# Altium project RELAY_BOARD_V1.PrjPcb (part 1 of 2)
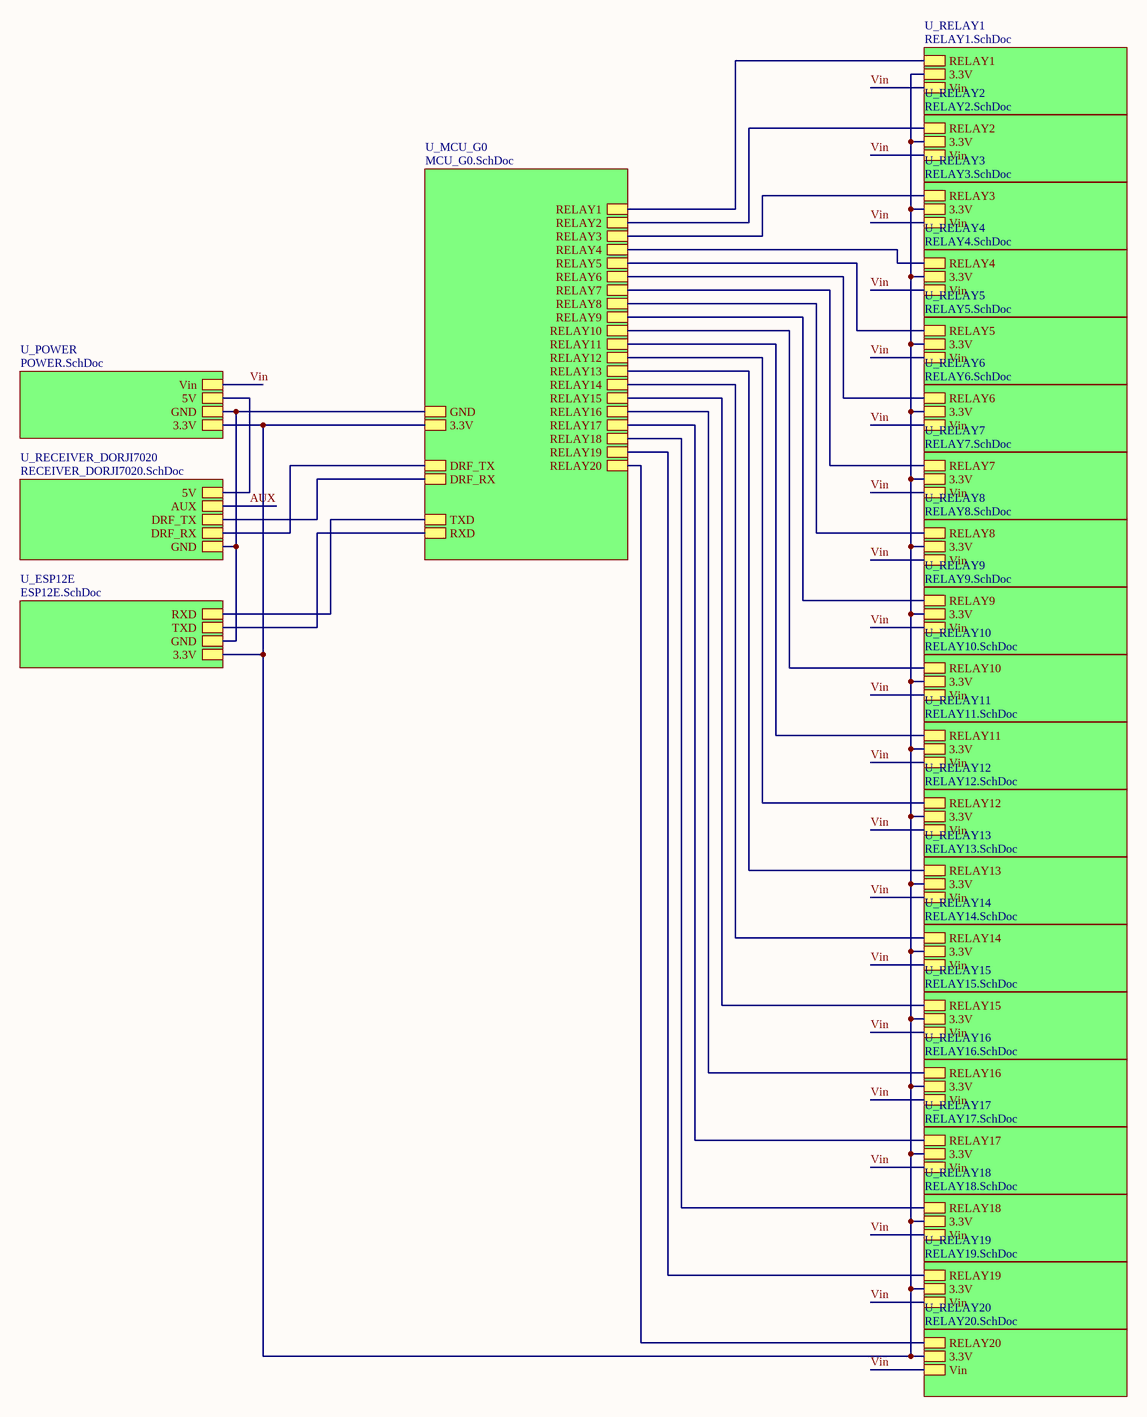
[diagram p0: RELAY_BOARD_V1.SchDoc]
25 sheets, 160 parts. Net scope: hierarchical (ports join the sheet entries above them; power ports are global).
Board files: RELAY_BOARD_V1_Assembly.PcbDoc, RELAY_BOARD_V1.PcbDoc
Sheets:
  RELAY_BOARD_V1.SchDoc
    U_MCU_G0 = MCU_G0.SchDoc
    U_RECEIVER_DORJI7020 = RECEIVER_DORJI7020.SchDoc
    U_ESP12E = ESP12E.SchDoc
    U_POWER = POWER.SchDoc
    U_RELAY1 = RELAY1.SchDoc
    U_RELAY2 = RELAY2.SchDoc
    U_RELAY3 = RELAY3.SchDoc
    U_RELAY4 = RELAY4.SchDoc
    U_RELAY5 = RELAY5.SchDoc
    U_RELAY6 = RELAY6.SchDoc
    U_RELAY7 = RELAY7.SchDoc
    U_RELAY8 = RELAY8.SchDoc
    U_RELAY9 = RELAY9.SchDoc
    U_RELAY10 = RELAY10.SchDoc
    U_RELAY11 = RELAY11.SchDoc
    U_RELAY12 = RELAY12.SchDoc
    U_RELAY13 = RELAY13.SchDoc
    U_RELAY14 = RELAY14.SchDoc
    U_RELAY15 = RELAY15.SchDoc
    U_RELAY16 = RELAY16.SchDoc
    U_RELAY17 = RELAY17.SchDoc
    U_RELAY18 = RELAY18.SchDoc
    U_RELAY19 = RELAY19.SchDoc
    U_RELAY20 = RELAY20.SchDoc

## Sheet RELAY_BOARD_V1.SchDoc
size A3

### Sub-sheets
U_ESP12E = ESP12E.SchDoc: RXD, TXD, GND, 3.3V
U_MCU_G0 = MCU_G0.SchDoc: DRF_TX, DRF_RX, TXD, RXD, 3.3V, GND, RELAY1, RELAY3, RELAY2, RELAY4, RELAY5, RELAY6, RELAY7, RELAY8, RELAY10, RELAY9, RELAY11, RELAY12, RELAY13, RELAY14, RELAY15, RELAY16, RELAY17, RELAY18, RELAY19, RELAY20
U_POWER = POWER.SchDoc: Vin, 5V, GND, 3.3V
U_RECEIVER_DORJI7020 = RECEIVER_DORJI7020.SchDoc: 5V, AUX, DRF_TX, DRF_RX, GND
U_RELAY1 = RELAY1.SchDoc: RELAY1, 3.3V, Vin
U_RELAY2 = RELAY2.SchDoc: RELAY2, 3.3V, Vin
U_RELAY3 = RELAY3.SchDoc: RELAY3, 3.3V, Vin
U_RELAY4 = RELAY4.SchDoc: RELAY4, 3.3V, Vin
U_RELAY5 = RELAY5.SchDoc: RELAY5, 3.3V, Vin
U_RELAY6 = RELAY6.SchDoc: RELAY6, 3.3V, Vin
U_RELAY7 = RELAY7.SchDoc: RELAY7, 3.3V, Vin
U_RELAY8 = RELAY8.SchDoc: RELAY8, 3.3V, Vin
U_RELAY9 = RELAY9.SchDoc: RELAY9, 3.3V, Vin
U_RELAY10 = RELAY10.SchDoc: RELAY10, 3.3V, Vin
U_RELAY11 = RELAY11.SchDoc: RELAY11, 3.3V, Vin
U_RELAY12 = RELAY12.SchDoc: RELAY12, 3.3V, Vin
U_RELAY13 = RELAY13.SchDoc: RELAY13, 3.3V, Vin
U_RELAY14 = RELAY14.SchDoc: RELAY14, 3.3V, Vin
U_RELAY15 = RELAY15.SchDoc: RELAY15, 3.3V, Vin
U_RELAY16 = RELAY16.SchDoc: RELAY16, 3.3V, Vin
U_RELAY17 = RELAY17.SchDoc: RELAY17, 3.3V, Vin
U_RELAY18 = RELAY18.SchDoc: RELAY18, 3.3V, Vin
U_RELAY19 = RELAY19.SchDoc: RELAY19, 3.3V, Vin
U_RELAY20 = RELAY20.SchDoc: RELAY20, 3.3V, Vin

### Nets
3.3V: sheet U_MCU_G0/3.3V, sheet U_ESP12E/3.3V, sheet U_POWER/3.3V, sheet U_RELAY1/3.3V, sheet U_RELAY2/3.3V, sheet U_RELAY3/3.3V, sheet U_RELAY4/3.3V, sheet U_RELAY5/3.3V, sheet U_RELAY6/3.3V, sheet U_RELAY7/3.3V, sheet U_RELAY8/3.3V, sheet U_RELAY9/3.3V, sheet U_RELAY10/3.3V, sheet U_RELAY11/3.3V, sheet U_RELAY12/3.3V, sheet U_RELAY13/3.3V, sheet U_RELAY14/3.3V, sheet U_RELAY15/3.3V, sheet U_RELAY16/3.3V, sheet U_RELAY17/3.3V, sheet U_RELAY18/3.3V, sheet U_RELAY19/3.3V, sheet U_RELAY20/3.3V
GND: sheet U_MCU_G0/GND, sheet U_RECEIVER_DORJI7020/GND, sheet U_ESP12E/GND, sheet U_POWER/GND
Vin: sheet U_RECEIVER_DORJI7020/5V, sheet U_POWER/Vin, sheet U_POWER/5V, sheet U_RELAY1/Vin, sheet U_RELAY2/Vin, sheet U_RELAY3/Vin, sheet U_RELAY4/Vin, sheet U_RELAY5/Vin, sheet U_RELAY6/Vin, sheet U_RELAY7/Vin, sheet U_RELAY8/Vin, sheet U_RELAY9/Vin, sheet U_RELAY10/Vin, sheet U_RELAY11/Vin, sheet U_RELAY12/Vin, sheet U_RELAY13/Vin, sheet U_RELAY14/Vin, sheet U_RELAY15/Vin, sheet U_RELAY16/Vin, sheet U_RELAY17/Vin, sheet U_RELAY18/Vin, sheet U_RELAY19/Vin, sheet U_RELAY20/Vin
RELAY1: sheet U_MCU_G0/RELAY1, sheet U_RELAY1/RELAY1
RELAY2: sheet U_MCU_G0/RELAY2, sheet U_RELAY2/RELAY2
RELAY3: sheet U_MCU_G0/RELAY3, sheet U_RELAY3/RELAY3
RELAY4: sheet U_MCU_G0/RELAY4, sheet U_RELAY4/RELAY4
RELAY5: sheet U_MCU_G0/RELAY5, sheet U_RELAY5/RELAY5
RELAY6: sheet U_MCU_G0/RELAY6, sheet U_RELAY6/RELAY6
RELAY7: sheet U_MCU_G0/RELAY7, sheet U_RELAY7/RELAY7
RELAY8: sheet U_MCU_G0/RELAY8, sheet U_RELAY8/RELAY8
RELAY9: sheet U_MCU_G0/RELAY9, sheet U_RELAY9/RELAY9
RELAY10: sheet U_MCU_G0/RELAY10, sheet U_RELAY10/RELAY10
RELAY11: sheet U_MCU_G0/RELAY11, sheet U_RELAY11/RELAY11
RELAY12: sheet U_MCU_G0/RELAY12, sheet U_RELAY12/RELAY12
RELAY13: sheet U_MCU_G0/RELAY13, sheet U_RELAY13/RELAY13
RELAY14: sheet U_MCU_G0/RELAY14, sheet U_RELAY14/RELAY14
RELAY15: sheet U_MCU_G0/RELAY15, sheet U_RELAY15/RELAY15
RELAY16: sheet U_MCU_G0/RELAY16, sheet U_RELAY16/RELAY16
RELAY17: sheet U_MCU_G0/RELAY17, sheet U_RELAY17/RELAY17
RELAY18: sheet U_MCU_G0/RELAY18, sheet U_RELAY18/RELAY18
RELAY19: sheet U_MCU_G0/RELAY19, sheet U_RELAY19/RELAY19
RELAY20: sheet U_MCU_G0/RELAY20, sheet U_RELAY20/RELAY20
RXD: sheet U_MCU_G0/TXD, sheet U_ESP12E/RXD
TXD: sheet U_MCU_G0/RXD, sheet U_ESP12E/TXD
UART1_RX_MCU_DRF_TX: sheet U_MCU_G0/DRF_TX, sheet U_RECEIVER_DORJI7020/DRF_RX
UART1_TX_MCU_DRF_RX: sheet U_MCU_G0/DRF_RX, sheet U_RECEIVER_DORJI7020/DRF_TX

## Sheet MCU_G0.SchDoc
size A1
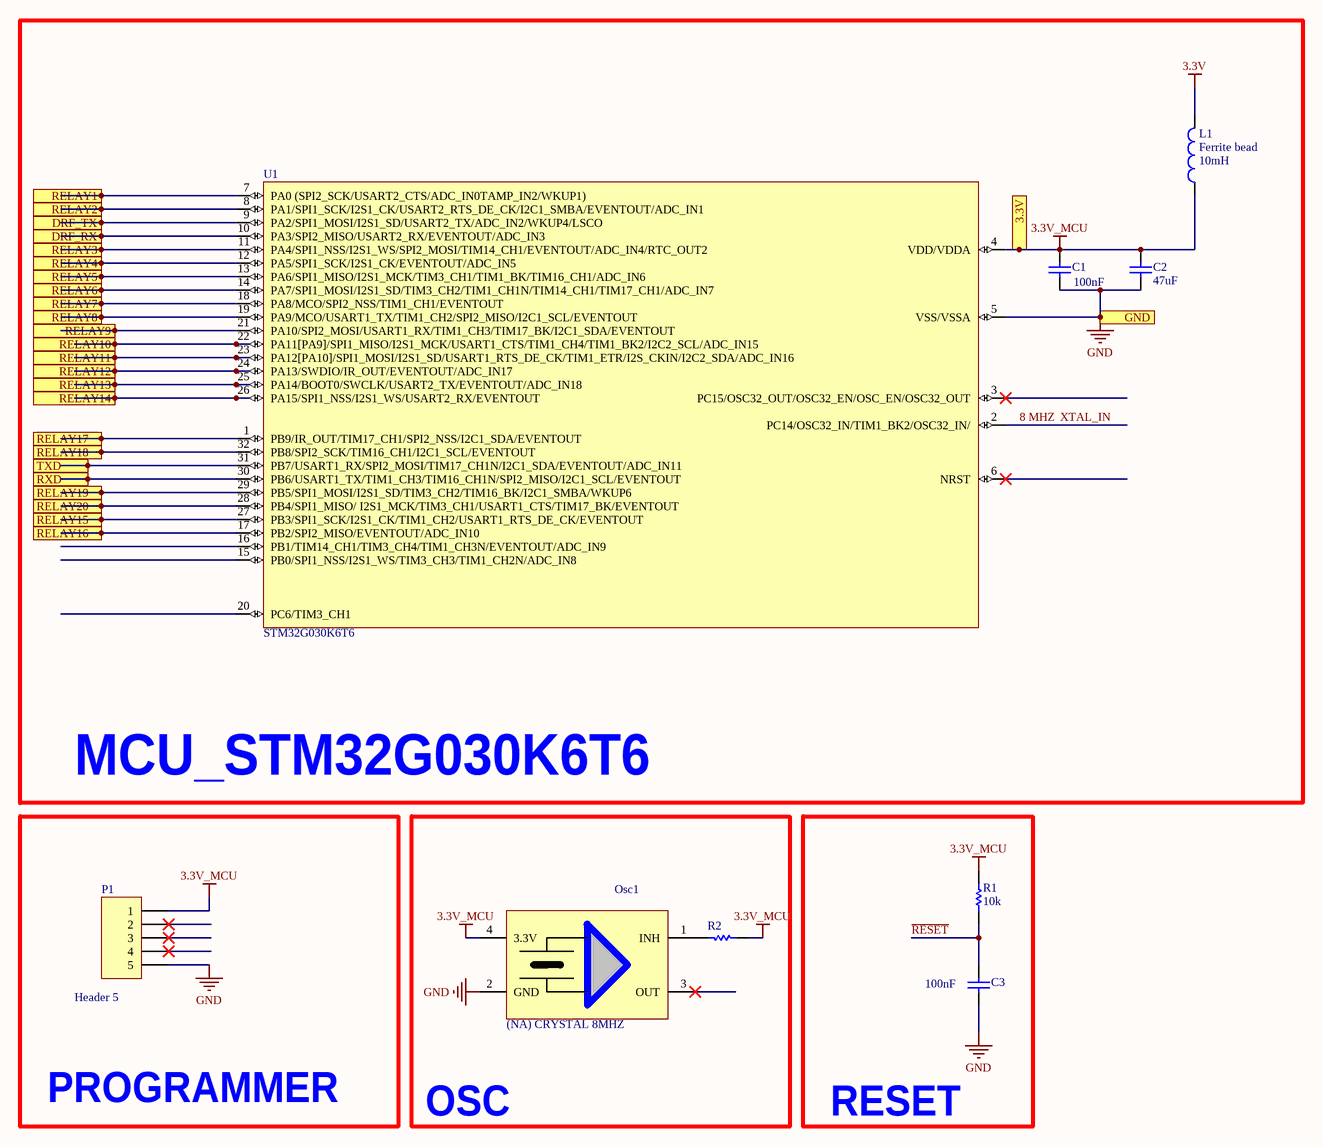
[diagram p1: MCU_G0.SchDoc]

### Parts
C1  100nF  [0603 - RESISTOR]
C2  47uF  [0603 - RESISTOR]
C3  100nF  [0603 - RESISTOR]
L1  Ferrite bead  value 10mH  [0603 - RESISTOR]
Osc1  (NA) CRYSTAL 8MHZ  [XTAL_5X7]
P1  Header 5  [HDR1X5_2mm_small]
R1  10k  [0603 - RESISTOR]
R2  (NA)10k  [0603 - RESISTOR]  (value not drawn)
U1  STM32G030K6T6  [LQFP32]

### Blocks framed on the sheet
MCU_STM32G030K6T6: C1 C2 L1 U1
PROGRAMMER: P1
OSC: Osc1 R2
RESET: C3 R1

### Ports
3.3V, DRF_RX, DRF_TX, GND, RELAY1, RELAY2, RELAY3, RELAY4, RELAY5, RELAY6, RELAY7, RELAY8, RELAY9, RELAY10, RELAY11, RELAY12, RELAY13, RELAY14, RELAY15, RELAY16, RELAY17, RELAY18, RELAY19, RELAY20, RXD, TXD

### Nets
3.3V: C1.2 C2.2 L1.1 L1.2 Osc1.4(3.3V) P1.1 R1.2 R2.1 U1.4(VDD/VDDA) ; port 3.3V  [also labelled 3.3V_MCU]
GND: C1.1 C2.1 C3.1 Osc1.2(GND) P1.5 U1.5(VSS/VSSA) ; port GND
8 MHZ: U1.2(PC14/OSC32_IN/TIM1_BK2/OSC32_IN/)  [also labelled XTAL_IN]
~{RESET}: C3.2 R1.1
RELAY1: U1.7(PA0_(SPI2_SCK/USART2_CTS/ADC_IN0TAMP_IN2/WKUP1)) ; port RELAY1
RELAY2: U1.8(PA1/SPI1_SCK/I2S1_CK/USART2_RTS_DE_CK/I2C1_SMBA/EVENTOUT/ADC_IN1) ; port RELAY2
RELAY3: U1.11(PA4/SPI1_NSS/I2S1_WS/SPI2_MOSI/TIM14_CH1/EVENTOUT/ADC_IN4/RTC_OUT2) ; port RELAY3
RELAY4: U1.12(PA5/SPI1_SCK/I2S1_CK/EVENTOUT/ADC_IN5) ; port RELAY4
RELAY5: U1.13(PA6/SPI1_MISO/I2S1_MCK/TIM3_CH1/TIM1_BK/TIM16_CH1/ADC_IN6) ; port RELAY5
RELAY6: U1.14(PA7/SPI1_MOSI/I2S1_SD/TIM3_CH2/TIM1_CH1N/TIM14_CH1/TIM17_CH1/ADC_IN7) ; port RELAY6
RELAY7: U1.18(PA8/MCO/SPI2_NSS/TIM1_CH1/EVENTOUT) ; port RELAY7
RELAY8: U1.19(PA9/MCO/USART1_TX/TIM1_CH2/SPI2_MISO/I2C1_SCL/EVENTOUT) ; port RELAY8
RELAY9: U1.21(PA10/SPI2_MOSI/USART1_RX/TIM1_CH3/TIM17_BK/I2C1_SDA/EVENTOUT) ; port RELAY9
RELAY10: U1.22(PA11[PA9]/SPI1_MISO/I2S1_MCK/USART1_CTS/TIM1_CH4/TIM1_BK2/I2C2_SCL/ADC_IN15) ; port RELAY10
RELAY11: U1.23(PA12[PA10]/SPI1_MOSI/I2S1_SD/USART1_RTS_DE_CK/TIM1_ETR/I2S_CKIN/I2C2_SDA/ADC_IN16) ; port RELAY11
RELAY12: U1.24(PA13/SWDIO/IR_OUT/EVENTOUT/ADC_IN17) ; port RELAY12
RELAY13: U1.25(PA14/BOOT0/SWCLK/USART2_TX/EVENTOUT/ADC_IN18) ; port RELAY13
RELAY14: U1.26(PA15/SPI1_NSS/I2S1_WS/USART2_RX/EVENTOUT) ; port RELAY14
RELAY15: U1.27(PB3/SPI1_SCK/I2S1_CK/TIM1_CH2/USART1_RTS_DE_CK/EVENTOUT) ; port RELAY15
RELAY16: U1.17(PB2/SPI2_MISO/EVENTOUT/ADC_IN10) ; port RELAY16
RELAY17: U1.1(PB9/IR_OUT/TIM17_CH1/SPI2_NSS/I2C1_SDA/EVENTOUT) ; port RELAY17
RELAY18: U1.32(PB8/SPI2_SCK/TIM16_CH1/I2C1_SCL/EVENTOUT) ; port RELAY18
RELAY19: U1.29(PB5/SPI1_MOSI/I2S1_SD/TIM3_CH2/TIM16_BK/I2C1_SMBA/WKUP6) ; port RELAY19
RELAY20: U1.28(PB4/SPI1_MISO/_I2S1_MCK/TIM3_CH1/USART1_CTS/TIM17_BK/EVENTOUT) ; port RELAY20
RXD: U1.31(PB7/USART1_RX/SPI2_MOSI/TIM17_CH1N/I2C1_SDA/EVENTOUT/ADC_IN11) ; port TXD
TXD: U1.30(PB6/USART1_TX/TIM1_CH3/TIM16_CH1N/SPI2_MISO/I2C1_SCL/EVENTOUT) ; port RXD
UART1_RX_MCU_DRF_TX: U1.9(PA2/SPI1_MOSI/I2S1_SD/USART2_TX/ADC_IN2/WKUP4/LSCO) ; port DRF_TX
UART1_TX_MCU_DRF_RX: U1.10(PA3/SPI2_MISO/USART2_RX/EVENTOUT/ADC_IN3) ; port DRF_RX
NetOsc1_1: Osc1.1(INH) R2.2

Not connected (* = marked no-connect by the designer): Osc1 3(OUT)*; P1 2* 3* 4*; U1 3(PC15/OSC32_OUT/OSC32_EN/OSC_EN/OSC32_OUT)* 6(NRST)* 15(PB0/SPI1_NSS/I2S1_WS/TIM3_CH3/TIM1_CH2N/ADC_IN8) 16(PB1/TIM14_CH1/TIM3_CH4/TIM1_CH3N/EVENTOUT/ADC_IN9) 20(PC6/TIM3_CH1)

### Library data of the parts
C1-C3 = Cap: Capacitor; Published: 8-Jun-2000; LatestRevisionDate: 17-Jul-2002; LatestRevisionNote: Re-released for DXP Platform.; PackageReference: RAD-0.3; Publisher: Altium Limited; PackageDescription: Radial Cap, Thru-Hole; 2 Leads; 0.3 in Pin Spacing
  C1 C3: Value: 100nF
  C2: Value: 47uF
L1 = Inductor: Code_IEC: 1005; Published: 8-Jun-2000; LatestRevisionDate: 29-May-2009; LatestRevisionNote: IPC-7351 Footprint Added.; PackageReference: 0402-A; Publisher: Altium Limited; PackageDescription: Chip Inductor; Code_JEITA: 0402
Osc1 = OSILATOR
P1 = Header 5: Header, 5-Pin; LatestRevisionDate: 17-Jul-2002; LatestRevisionNote: Re-released for DXP Platform.; Publisher: Altium Limited
R1 R2 = Res1: Resistor; Published: 8-Jun-2000; LatestRevisionDate: 17-Jul-2002; LatestRevisionNote: Re-released for DXP Platform.; PackageReference: AXIAL-0.3; Publisher: Altium Limited; PackageDescription: Axial Device, Thru-Hole; 2 Leads; 0.3 in Pin Spacing
  R1: Value: 10k
  R2: Value: (NA)10k
U1 = STM32G030K6T6: ARMÂ® CortexÂ®-M0+ STM32G0 Microcontroller IC 32-Bit 64MHz 32KB (32K x 8) FLASH 32-LQFP (7x7); MF: STMicroelectronics; Purchase-URL: https://pricing.snapeda.com/search/part/STM32G030K6T6/?ref=eda; Check_prices: https://www.snapeda.com/parts/STM32G030K6T6/STMicroelectronics/view-part/4001295/?ref=eda; Value: *; MP: STM32G030K6T6; SnapEDA_Link: https://www.snapeda.com/parts/STM32G030K6T6/STMicroelectronics/view-part/4001295/?ref=snap; Availability: In Stock; Price: None; Package: LQFP-32 STMicroelectronics

## Sheet RECEIVER_DORJI7020.SchDoc
size A4
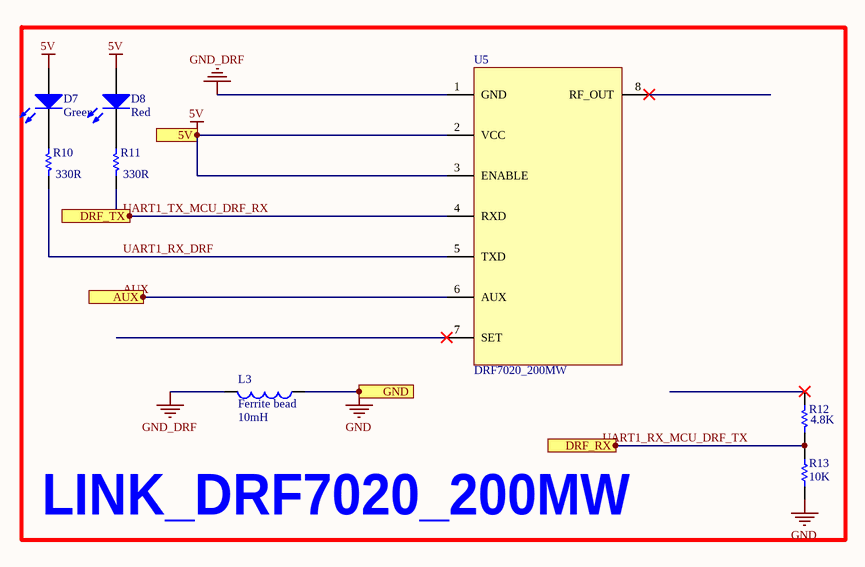
[diagram p2: RECEIVER_DORJI7020.SchDoc]

### Parts
D7  Green  [0603 -LED_GREEN - duplicate]
D8  Red  [0603 -LED_GREEN - duplicate]
L3  Ferrite bead  value 10mH  [0603 - RESISTOR]
R10  330R  [0603 - RESISTOR]
R11  330R  [0603 - RESISTOR]
R12  4.8K  [0603 - RESISTOR]
R13  10K  [0603 - RESISTOR]
U5  DRF7020_200MW  [DRF7020D13_MODULE_200MW]

### Blocks framed on the sheet
LINK_DRF7020_200MW: D7 D8 L3 R10-R13 U5

### Ports
5V, AUX, DRF_RX, DRF_TX, GND

### Nets
5V: D7.1(A) D8.1(A) U5.2(VCC) U5.3(ENABLE) ; port 5V  [project net Vin]
GND: L3.1 R13.2 ; port GND
GND_DRF: L3.2 U5.1(GND)
AUX: U5.6(AUX) ; port AUX
UART1_RX_DRF: R10.2 U5.5(TXD)
UART1_RX_MCU_DRF_TX: R12.2 R13.1 ; port DRF_RX
UART1_TX_MCU_DRF_RX: R11.2 U5.4(RXD) ; port DRF_TX
NetD7_2: D7.2(K) R10.1
NetD8_2: D8.2(K) R11.1

Not connected (* = marked no-connect by the designer): R12 1*; U5 7(SET)* 8(RF_OUT)*

### Library data of the parts
D7 D8 = LED0: Typical INFRARED GaAs LED; Published: 8-Jun-2000; LatestRevisionDate: 08-Jul-2005; LatestRevisionNote: Mech Layer 1 removed.; PackageReference: LED-0; Publisher: Altium Limited; PackageDescription: LED; 2 Leads
L3 = Inductor: Code_IEC: 1005; Published: 8-Jun-2000; LatestRevisionDate: 29-May-2009; LatestRevisionNote: IPC-7351 Footprint Added.; PackageReference: 0402-A; Publisher: Altium Limited; PackageDescription: Chip Inductor; Code_JEITA: 0402
R10-R12 = Res1: Resistor; Published: 8-Jun-2000; LatestRevisionDate: 17-Jul-2002; LatestRevisionNote: Re-released for DXP Platform.; PackageReference: AXIAL-0.3; Publisher: Altium Limited; PackageDescription: Axial Device, Thru-Hole; 2 Leads; 0.3 in Pin Spacing
  R10 R11: Value: 330R
  R12: Value: 4.8K
R13 = Res Semi: Semiconductor Resistor; Published: 8-Jun-2000; LatestRevisionDate: 17-Jul-2002; LatestRevisionNote: Re-released for DXP Platform.; PackageReference: AXIAL-0.5; Publisher: Altium Limited; Value: 10k

## Sheet ESP12E.SchDoc
size A4
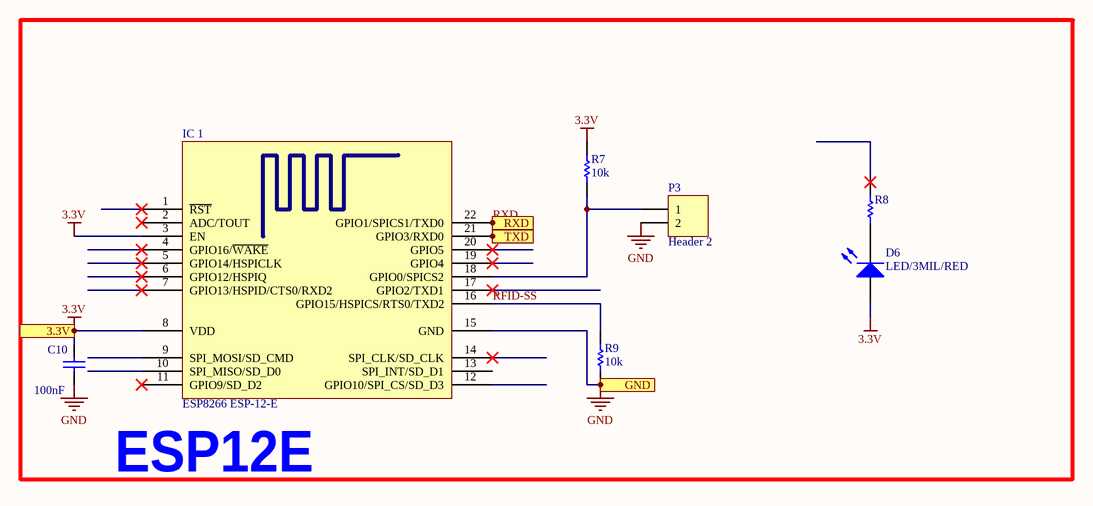
[diagram p3: ESP12E.SchDoc]

### Parts
C10  100nF  [0805 - CAP]
D6  LED/3MIL/RED  [Led_3mil -2 - duplicate]
IC_1  ESP8266 ESP-12-E  [ESP8266 ESP-12-E]
P3  Header 2  [HDR1X2]
R7  10k  [0805/resistor]
R8  470R  [0805/resistor]  (value not drawn)
R9  10k  [0805/resistor]

### Ports
3.3V, GND, RXD, TXD

### Nets
3.3V: C10.2 D6.1(A) IC_1.3(EN) IC_1.8(VDD) R7.2 ; port 3.3V
GND: C10.1 IC_1.15(GND) P3.2 R9.1 ; port GND
RFID-SS: IC_1.16(GPIO15/HSPICS/RTS0/TXD2) R9.2
RXD: IC_1.22(GPIO1/SPICS1/TXD0) ; port RXD
TXD: IC_1.21(GPIO3/RXD0) ; port TXD
NetD6_2: D6.2(K) R8.1
NetIC_1_18: IC_1.18(GPIO0/SPICS2) P3.1 R7.1

Not connected (* = marked no-connect by the designer): IC_1 1(~{RST})* 2(ADC/TOUT)* 4(GPIO16/~{WAKE})* 5(GPIO14/HSPICLK)* 6(GPIO12/HSPIQ)* 7(GPIO13/HSPID/CTS0/RXD2)* 9(SPI_MOSI/SD_CMD) 10(SPI_MISO/SD_D0) 11(GPIO9/SD_D2)* 12(GPIO10/SPI_CS/SD_D3) 13(SPI_INT/SD_D1) 14(SPI_CLK/SD_CLK)* 17(GPIO2/TXD1)* 19(GPIO4)* 20(GPIO5)*; R8 2*

### Notes on the sheet
- (near IC_1) ESP12E

### Library data of the parts
C10 = Cap: Capacitor; Published: 8-Jun-2000; LatestRevisionDate: 17-Jul-2002; LatestRevisionNote: Re-released for DXP Platform.; PackageReference: RAD-0.3; Publisher: Altium Limited; PackageDescription: Radial Cap, Thru-Hole; 2 Leads; 0.3 in Pin Spacing; Value: 100nF
D6 = LED0: Typical INFRARED GaAs LED; Published: 8-Jun-2000; LatestRevisionDate: 08-Jul-2005; LatestRevisionNote: Mech Layer 1 removed.; PackageReference: LED-0; Publisher: Altium Limited; PackageDescription: LED; 2 Leads
P3 = Header 2: Header, 2-Pin; LatestRevisionDate: 17-Jul-2002; LatestRevisionNote: Re-released for DXP Platform.; Publisher: Altium Limited
R7-R9 = Res1: Resistor; Published: 8-Jun-2000; LatestRevisionDate: 17-Jul-2002; LatestRevisionNote: Re-released for DXP Platform.; PackageReference: AXIAL-0.3; Publisher: Altium Limited; PackageDescription: Axial Device, Thru-Hole; 2 Leads; 0.3 in Pin Spacing
  R7 R9: Value: 10k
  R8: Value: 470R

## Sheet POWER.SchDoc
size A4
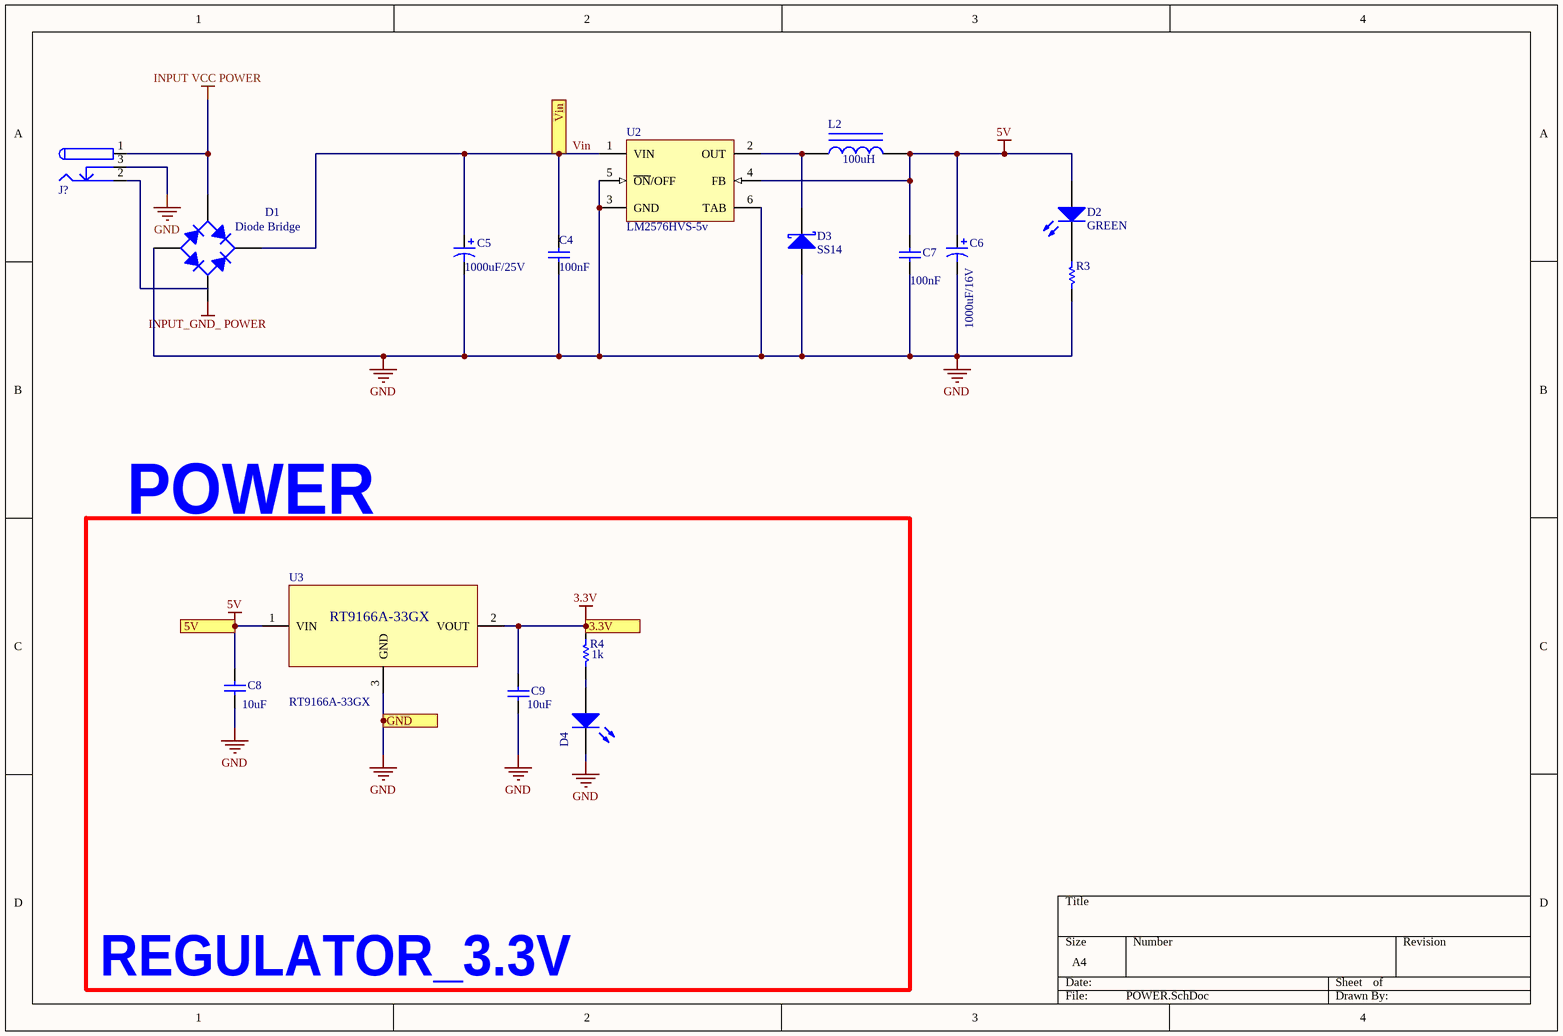
[diagram p4: POWER.SchDoc]

### Parts
C4  100nF  [0805 - CAP]
C5  1000uF/25V  [Rad.1/.2-SMALL 8*16 - duplicate]
C6  1000uF/16V  [Rad.1/.2-SMALL 8*16]
C7  100nF  [0805 - CAP]
C8  10uF  [0603 - RESISTOR]
C9  10uF  [0603 - RESISTOR]
D1  Diode Bridge  [Bridge]
D2  GREEN  [0805AK_green]
D3  SS14  [ss14 / sma]
D4  GREEN  [0603 -LED_GREEN - duplicate]  (value not drawn)
J?  DC Power Jack  [DC Power Jack 1]  (value not drawn)
L2  100uH  [IND_SMD12X12]
R3  330R  [0805/resistor]  (value not drawn)
R4  1k  [0603 - RESISTOR]
U2  LM2576HVS-5v  [lm2576/adj/TS5B_N]
U3  RT9166A-33GX  [SOT89 (RT9166)]

### Blocks framed on the sheet
POWER: C8 C9 D4 R4 U3

### Ports
3.3V, 5V, GND, Vin

### Nets
3.3V: C9.1 R4.1 U3.2(VOUT) ; port 3.3V
GND: C4.1 C5.2 C6.2 C7.1 C8.1 C9.2 D1.3(A) D3.1(A) D4.2(K) J?.3 R3.2 U2.3(GND) U2.5(~{ON}/OFF) U2.6(TAB) U3.3(GND) ; port GND
INPUT VCC POWER: D1.4(C) J?.1
INPUT_GND_ POWER: D1.2(C)
Vin: C4.2 C5.1 C6.1 C7.2 C8.2 D1.1(K) D2.1(A) L2.2 U2.1(VIN) U2.4(FB) U3.1(VIN) ; port Vin, port 5V  [also labelled 5V]
NetD2_2: D2.2(K) R3.1
NetD3_2: D3.2(K) L2.1 U2.2(OUT)
NetD4_1: D4.1(A) R4.2

Not connected (* = marked no-connect by the designer): J? 2

### Notes on the sheet
- REGULATOR_3.3V

### Library data of the parts
C4 C7-C9 = Cap: Capacitor; Published: 8-Jun-2000; LatestRevisionDate: 17-Jul-2002; LatestRevisionNote: Re-released for DXP Platform.; PackageReference: RAD-0.3; Publisher: Altium Limited; PackageDescription: Radial Cap, Thru-Hole; 2 Leads; 0.3 in Pin Spacing
  C4 C7: Value: 100nF
  C8 C9: Value: 10uF
C5 C6 = Cap Pol1: Polarized Capacitor (Radial); Published: 8-Jun-2000; LatestRevisionDate: 17-Jul-2002; LatestRevisionNote: Re-released for DXP Platform.; PackageReference: RB7.6-15; Publisher: Altium Limited; PackageDescription: Polarized Capacitor (Radial); 2 Leads
  C5: Value: 1000uF/25V
  C6: Value: 1000uF/16V
D1 = Diode Bridge: Full Wave Diode Bridge; Company: E.P.I.L; Design Date: 2011/11/02
D2 = LED0: Typical INFRARED GaAs LED; Published: 8-Jun-2000; LatestRevisionDate: 08-Jul-2005; LatestRevisionNote: Mech Layer 1 removed.; PackageReference: LED-0; Publisher: Altium Limited; PackageDescription: LED; 2 Leads
D3 = Diode 1N5822: Silicon AF Schottky Diode for High-Speed Switching; Note: Pin 2 is not connected and not drawn.; Published: 21-Mar-2003; LatestRevisionDate: 29-May-2009; LatestRevisionNote: IPC-7351 Footprint Added.; DatasheetVersion: Oct-1999; PackageVersion: Sep-2001; PackageReference: SOT-23; Publisher: Altium Limited; PackageDescription: 3-Pin SOT-23 Package 0.95 mm Pitch, 2.5 mm Lead Span; ComponentLink1Description: Manufacturer Link; ComponentLink1URL: http://www.infineon.com/; ComponentLink2Description: Datasheet; ComponentLink2URL: http://www.infineon.com/upload/Document/cmc_upload/documents/009/382/bas40_bas140series_1.pdf
D4 = LED SMD
J? = DC Power Jack: DC Power Jack. Center Pin 2.5mm. Diameter: 5.7mm; Designer: Ali Hafizi; Company: Personal; Project Name: Laser; Adding Date: 10/21/2009
L2 = Inductor Iron: CD54-100MT-10UH; Published: 24-Mar-1999; LatestRevisionDate: 17-Jul-2002; LatestRevisionNote: Re-released for DXP Platform.; PackageReference: AXIAL-0.9; Publisher: Altium Limited; PackageDescription: Axial Device, Thru-Hole; 2 Leads; 0.9 in Pin Spacing; Value: 100uH
R3 R4 = Res1: Resistor; Published: 8-Jun-2000; LatestRevisionDate: 17-Jul-2002; LatestRevisionNote: Re-released for DXP Platform.; PackageReference: AXIAL-0.3; Publisher: Altium Limited; PackageDescription: Axial Device, Thru-Hole; 2 Leads; 0.3 in Pin Spacing
  R3: Value: 330R
  R4: Value: 1k
U2 = LM2576HVS-ADJ: SIMPLE SWITCHER® 3A Step-Down Voltage Regulator, 5-pin TO-263; Manufacturer: National Semiconductor; PackageTopMarking: NSUZXYTTE#*LM2576*HVS-ADJ P+; PowerWise: N; High-Reliability: Y; DatasheetVersion: Aug-2004; PackageVersion: revD, Apr-2005; PackageReference: TS5B; PackageDescription: TO-263, Molded, .400 x .390 x .180in, 5 Lead, .067in Pitch, Surface Mount; PartNumber: LM2576HVS-ADJ; RoHS: N; PinCount: 5; CompType: Switcher; Code_JEDEC: MO-169-AB; ComponentLink1Description: Manufacturer URL; ComponentLink1URL: http://www.national.com/; ComponentLink2Description: LM2576HV Datasheet; ComponentLink2URL: http://www.national.com/ds/LM/LM2576HV.pdf; ComponentLink3Description: LM2576HV Web Page; ComponentLink3URL: http://www.national.com/pf/LM/LM2576HV.html; ComponentLink4Description: TS5B Package Page; ComponentLink4URL: http://www.national.com/packaging/folders/ts5b.html
U3 = RT9166A-33GX: REGULATOR 3.3V; Manufacturer_Name: Vishay; Manufacturer_Part_Number: 2N7002; Datasheet Link: https://www.diodes.com/assets/Datasheets/ds11303.pdf; Height: 1.2mm; Mouser Part Number: 781-2N7002; Mouser Price/Stock: https://www.mouser.com/Search/Refine.aspx?Keyword=781-2N7002; RS Part Number: 2370907P; RS Price/Stock: http://uk.rs-online.com/web/p/products/2370907P

## Sheet RELAY1.SchDoc
size A4
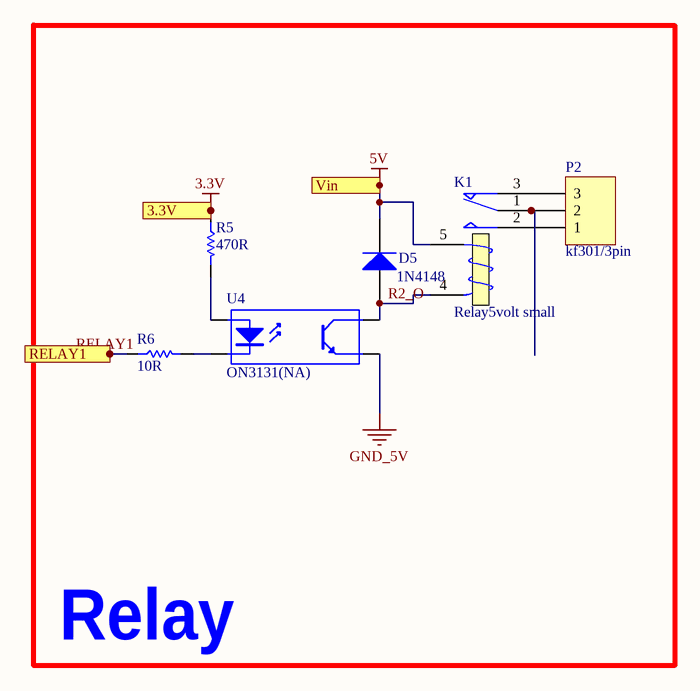
[diagram p5: RELAY1.SchDoc]

### Parts
D5  1N4148  [sod123]
K1  Relay5volt small  [relay5_childern]
P2  kf301/3pin  [Blue Connector 1*3 -kf301]
R5  470R  [0805/resistor]
R6  10R  [0805/resistor]
U4  ON3131(NA)  [OPTO_COUPLER]

### Blocks framed on the sheet
Relay: D5 K1 P2 R5 R6 U4

### Ports
3.3V, RELAY1, Vin

### Nets
3.3V: R5.1 ; port 3.3V
5V: D5.K K1.5 ; port Vin  [project net Vin]
GND_5V: U4.3(E)
R2_O: D5.A K1.4(T2) U4.4(C)
RELAY1: R6.1 ; port RELAY1
NetK1_1: K1.1(COM) P2.2
NetK1_2: K1.2(NO) P2.1
NetK1_3: K1.3(T1) P2.3
NetR5_2: R5.2 U4.1(A)
NetR6_2: R6.2 U4.2(K)

### Library data of the parts
D5 = Diode 1N4007: 1 Amp General Purpose Rectifier; Published: 8-Jun-2000; LatestRevisionDate: 17-Jul-2002; LatestRevisionNote: Re-released for DXP Platform.; DatasheetVersion: 1998; PackageVersion: Aug-1999; PackageReference: DO-41; Publisher: Altium Limited; PackageDescription: Diode, Axial; Body 5.2 x 2.7 mm (LxDia. max), Lead Dia. 0.86 mm (max); Code_JEDEC: DO-204-AL; ComponentLink1Description: Manufacturer Link; ComponentLink1URL: http://www.fairchildsemi.com/; ComponentLink2Description: Datasheet; ComponentLink2URL: http://www.fairchildsemi.com/ds/1N%2F1N4001.pdf
K1 = Relay: SPDT Relay; Published: 8-Jun-2000; LatestRevisionDate: 17-Jul-2002; LatestRevisionNote: Re-released for DXP Platform.; PackageReference: MODULE5B; Publisher: Altium Limited
P2 = Header 3: LatestRevisionDate: 17-Jul-2002; LatestRevisionNote: Re-released for DXP Platform.; Publisher: Altium Limited
R5 R6 = Resistor: Tolerance: 5%; Power: 1/8 W
  R5: Value: 470R
  R6: Value: 10R
U4 = Optoisolator1: 4-Pin Phototransistor Optocoupler; Published: 24-Mar-1999; LatestRevisionDate: 04-Mar-2005; LatestRevisionNote: Sch pins 3 & 4 Swapped.; DatasheetVersion: Nov-2003; PackageReference: DIP-4; Publisher: Altium Limited

## Sheet RELAY2.SchDoc
size A
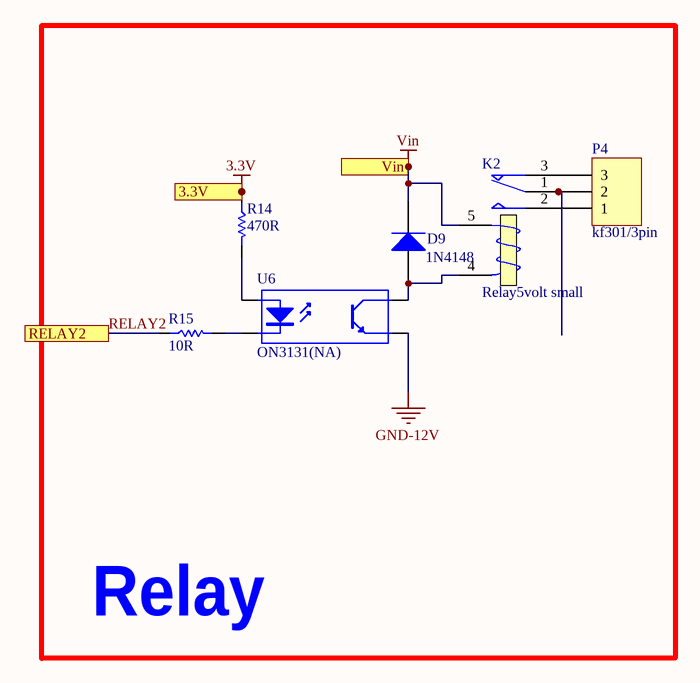
[diagram p6: RELAY2.SchDoc]

### Parts
D9  1N4148  [sod123]
K2  Relay5volt small  [relay5_childern]
P4  kf301/3pin  [Blue Connector 1*3 -kf301]
R14  470R  [0805/resistor]
R15  10R  [0805/resistor]
U6  ON3131(NA)  [OPTO_COUPLER]

### Blocks framed on the sheet
Relay: D9 K2 P4 R14 R15 U6

### Ports
3.3V, RELAY2, Vin

### Nets
3.3V: R14.1 ; port 3.3V
GND-12V: U6.3(E)
Vin: D9.K K2.5 ; port Vin
RELAY2: R15.1 ; port RELAY2
NetD9_A: D9.A K2.4(T2) U6.4(C)
NetK2_1: K2.1(COM) P4.2
NetK2_2: K2.2(NO) P4.1
NetK2_3: K2.3(T1) P4.3
NetR14_2: R14.2 U6.1(A)
NetR15_2: R15.2 U6.2(K)

### Library data of the parts
D9 = Diode 1N4007: 1 Amp General Purpose Rectifier; Published: 8-Jun-2000; LatestRevisionDate: 17-Jul-2002; LatestRevisionNote: Re-released for DXP Platform.; DatasheetVersion: 1998; PackageVersion: Aug-1999; PackageReference: DO-41; Publisher: Altium Limited; PackageDescription: Diode, Axial; Body 5.2 x 2.7 mm (LxDia. max), Lead Dia. 0.86 mm (max); Code_JEDEC: DO-204-AL; ComponentLink1Description: Manufacturer Link; ComponentLink1URL: http://www.fairchildsemi.com/; ComponentLink2Description: Datasheet; ComponentLink2URL: http://www.fairchildsemi.com/ds/1N%2F1N4001.pdf
K2 = Relay: SPDT Relay; Published: 8-Jun-2000; LatestRevisionDate: 17-Jul-2002; LatestRevisionNote: Re-released for DXP Platform.; PackageReference: MODULE5B; Publisher: Altium Limited
P4 = Header 3: LatestRevisionDate: 17-Jul-2002; LatestRevisionNote: Re-released for DXP Platform.; Publisher: Altium Limited
R14 R15 = Resistor: Tolerance: 5%; Power: 1/8 W
  R14: Value: 470R
  R15: Value: 10R
U6 = Optoisolator1: 4-Pin Phototransistor Optocoupler; Published: 24-Mar-1999; LatestRevisionDate: 04-Mar-2005; LatestRevisionNote: Sch pins 3 & 4 Swapped.; DatasheetVersion: Nov-2003; PackageReference: DIP-4; Publisher: Altium Limited

## Sheet RELAY3.SchDoc
size A
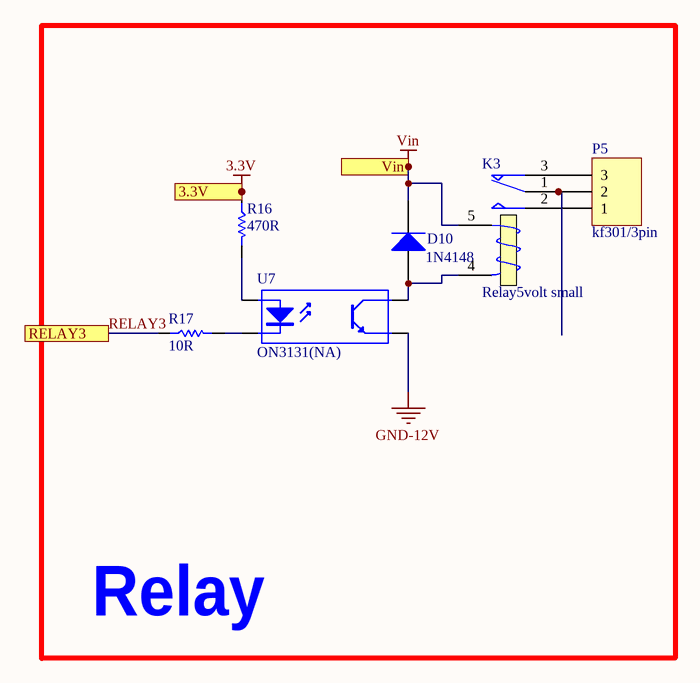
[diagram p7: RELAY3.SchDoc]

### Parts
D10  1N4148  [sod123]
K3  Relay5volt small  [relay5_childern]
P5  kf301/3pin  [Blue Connector 1*3 -kf301]
R16  470R  [0805/resistor]
R17  10R  [0805/resistor]
U7  ON3131(NA)  [OPTO_COUPLER]

### Blocks framed on the sheet
Relay: D10 K3 P5 R16 R17 U7

### Ports
3.3V, RELAY3, Vin

### Nets
3.3V: R16.1 ; port 3.3V
GND-12V: U7.3(E)
Vin: D10.K K3.5 ; port Vin
RELAY3: R17.1 ; port RELAY3
NetD10_A: D10.A K3.4(T2) U7.4(C)
NetK3_1: K3.1(COM) P5.2
NetK3_2: K3.2(NO) P5.1
NetK3_3: K3.3(T1) P5.3
NetR16_2: R16.2 U7.1(A)
NetR17_2: R17.2 U7.2(K)

### Library data of the parts
D10 = Diode 1N4007: 1 Amp General Purpose Rectifier; Published: 8-Jun-2000; LatestRevisionDate: 17-Jul-2002; LatestRevisionNote: Re-released for DXP Platform.; DatasheetVersion: 1998; PackageVersion: Aug-1999; PackageReference: DO-41; Publisher: Altium Limited; PackageDescription: Diode, Axial; Body 5.2 x 2.7 mm (LxDia. max), Lead Dia. 0.86 mm (max); Code_JEDEC: DO-204-AL; ComponentLink1Description: Manufacturer Link; ComponentLink1URL: http://www.fairchildsemi.com/; ComponentLink2Description: Datasheet; ComponentLink2URL: http://www.fairchildsemi.com/ds/1N%2F1N4001.pdf
K3 = Relay: SPDT Relay; Published: 8-Jun-2000; LatestRevisionDate: 17-Jul-2002; LatestRevisionNote: Re-released for DXP Platform.; PackageReference: MODULE5B; Publisher: Altium Limited
P5 = Header 3: LatestRevisionDate: 17-Jul-2002; LatestRevisionNote: Re-released for DXP Platform.; Publisher: Altium Limited
R16 R17 = Resistor: Tolerance: 5%; Power: 1/8 W
  R16: Value: 470R
  R17: Value: 10R
U7 = Optoisolator1: 4-Pin Phototransistor Optocoupler; Published: 24-Mar-1999; LatestRevisionDate: 04-Mar-2005; LatestRevisionNote: Sch pins 3 & 4 Swapped.; DatasheetVersion: Nov-2003; PackageReference: DIP-4; Publisher: Altium Limited

## Sheet RELAY4.SchDoc
size A
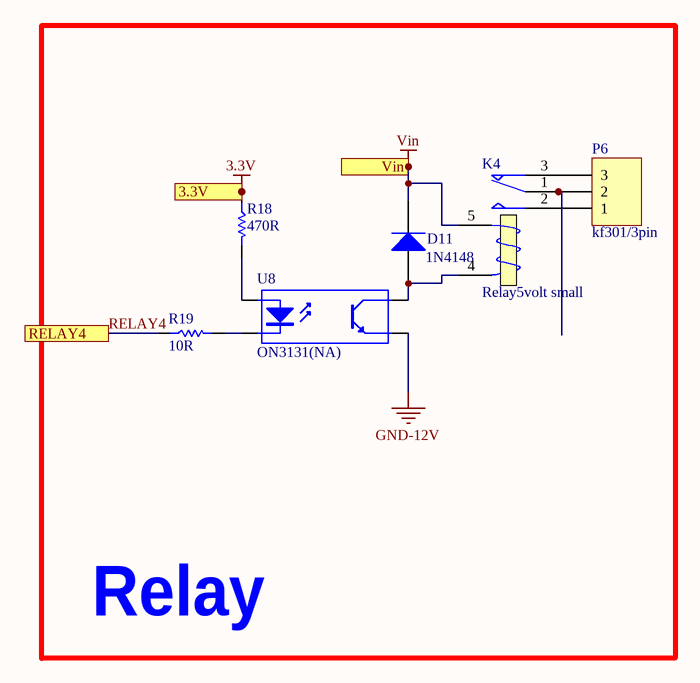
[diagram p8: RELAY4.SchDoc]

### Parts
D11  1N4148  [sod123]
K4  Relay5volt small  [relay5_childern]
P6  kf301/3pin  [Blue Connector 1*3 -kf301]
R18  470R  [0805/resistor]
R19  10R  [0805/resistor]
U8  ON3131(NA)  [OPTO_COUPLER]

### Blocks framed on the sheet
Relay: D11 K4 P6 R18 R19 U8

### Ports
3.3V, RELAY4, Vin

### Nets
3.3V: R18.1 ; port 3.3V
GND-12V: U8.3(E)
Vin: D11.K K4.5 ; port Vin
RELAY4: R19.1 ; port RELAY4
NetD11_A: D11.A K4.4(T2) U8.4(C)
NetK4_1: K4.1(COM) P6.2
NetK4_2: K4.2(NO) P6.1
NetK4_3: K4.3(T1) P6.3
NetR18_2: R18.2 U8.1(A)
NetR19_2: R19.2 U8.2(K)

### Library data of the parts
D11 = Diode 1N4007: 1 Amp General Purpose Rectifier; Published: 8-Jun-2000; LatestRevisionDate: 17-Jul-2002; LatestRevisionNote: Re-released for DXP Platform.; DatasheetVersion: 1998; PackageVersion: Aug-1999; PackageReference: DO-41; Publisher: Altium Limited; PackageDescription: Diode, Axial; Body 5.2 x 2.7 mm (LxDia. max), Lead Dia. 0.86 mm (max); Code_JEDEC: DO-204-AL; ComponentLink1Description: Manufacturer Link; ComponentLink1URL: http://www.fairchildsemi.com/; ComponentLink2Description: Datasheet; ComponentLink2URL: http://www.fairchildsemi.com/ds/1N%2F1N4001.pdf
K4 = Relay: SPDT Relay; Published: 8-Jun-2000; LatestRevisionDate: 17-Jul-2002; LatestRevisionNote: Re-released for DXP Platform.; PackageReference: MODULE5B; Publisher: Altium Limited
P6 = Header 3: LatestRevisionDate: 17-Jul-2002; LatestRevisionNote: Re-released for DXP Platform.; Publisher: Altium Limited
R18 R19 = Resistor: Tolerance: 5%; Power: 1/8 W
  R18: Value: 470R
  R19: Value: 10R
U8 = Optoisolator1: 4-Pin Phototransistor Optocoupler; Published: 24-Mar-1999; LatestRevisionDate: 04-Mar-2005; LatestRevisionNote: Sch pins 3 & 4 Swapped.; DatasheetVersion: Nov-2003; PackageReference: DIP-4; Publisher: Altium Limited

## Sheet RELAY5.SchDoc
size A
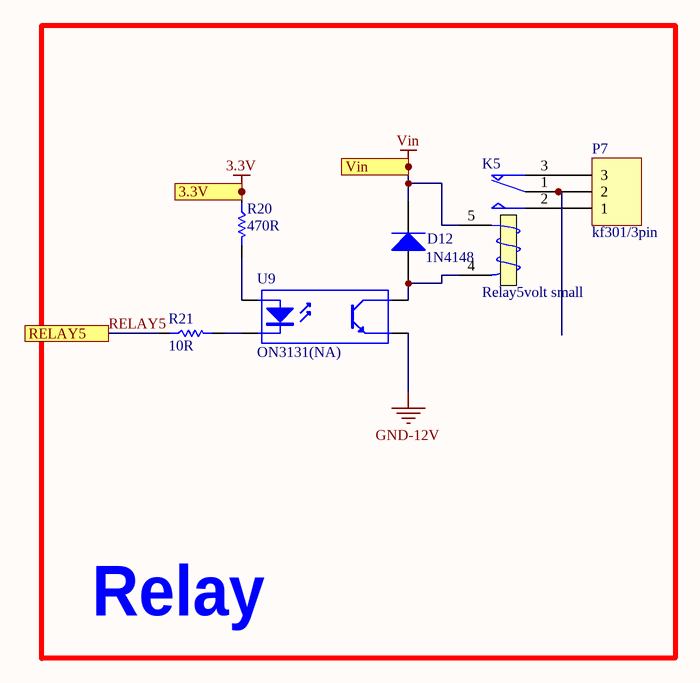
[diagram p9: RELAY5.SchDoc]

### Parts
D12  1N4148  [sod123]
K5  Relay5volt small  [relay5_childern]
P7  kf301/3pin  [Blue Connector 1*3 -kf301]
R20  470R  [0805/resistor]
R21  10R  [0805/resistor]
U9  ON3131(NA)  [OPTO_COUPLER]

### Blocks framed on the sheet
Relay: D12 K5 P7 R20 R21 U9

### Ports
3.3V, RELAY5, Vin

### Nets
3.3V: R20.1 ; port 3.3V
GND-12V: U9.3(E)
Vin: D12.K K5.5 ; port Vin
RELAY5: R21.1 ; port RELAY5
NetD12_A: D12.A K5.4(T2) U9.4(C)
NetK5_1: K5.1(COM) P7.2
NetK5_2: K5.2(NO) P7.1
NetK5_3: K5.3(T1) P7.3
NetR20_2: R20.2 U9.1(A)
NetR21_2: R21.2 U9.2(K)

### Library data of the parts
D12 = Diode 1N4007: 1 Amp General Purpose Rectifier; Published: 8-Jun-2000; LatestRevisionDate: 17-Jul-2002; LatestRevisionNote: Re-released for DXP Platform.; DatasheetVersion: 1998; PackageVersion: Aug-1999; PackageReference: DO-41; Publisher: Altium Limited; PackageDescription: Diode, Axial; Body 5.2 x 2.7 mm (LxDia. max), Lead Dia. 0.86 mm (max); Code_JEDEC: DO-204-AL; ComponentLink1Description: Manufacturer Link; ComponentLink1URL: http://www.fairchildsemi.com/; ComponentLink2Description: Datasheet; ComponentLink2URL: http://www.fairchildsemi.com/ds/1N%2F1N4001.pdf
K5 = Relay: SPDT Relay; Published: 8-Jun-2000; LatestRevisionDate: 17-Jul-2002; LatestRevisionNote: Re-released for DXP Platform.; PackageReference: MODULE5B; Publisher: Altium Limited
P7 = Header 3: LatestRevisionDate: 17-Jul-2002; LatestRevisionNote: Re-released for DXP Platform.; Publisher: Altium Limited
R20 R21 = Resistor: Tolerance: 5%; Power: 1/8 W
  R20: Value: 470R
  R21: Value: 10R
U9 = Optoisolator1: 4-Pin Phototransistor Optocoupler; Published: 24-Mar-1999; LatestRevisionDate: 04-Mar-2005; LatestRevisionNote: Sch pins 3 & 4 Swapped.; DatasheetVersion: Nov-2003; PackageReference: DIP-4; Publisher: Altium Limited

## Sheet RELAY6.SchDoc
size A
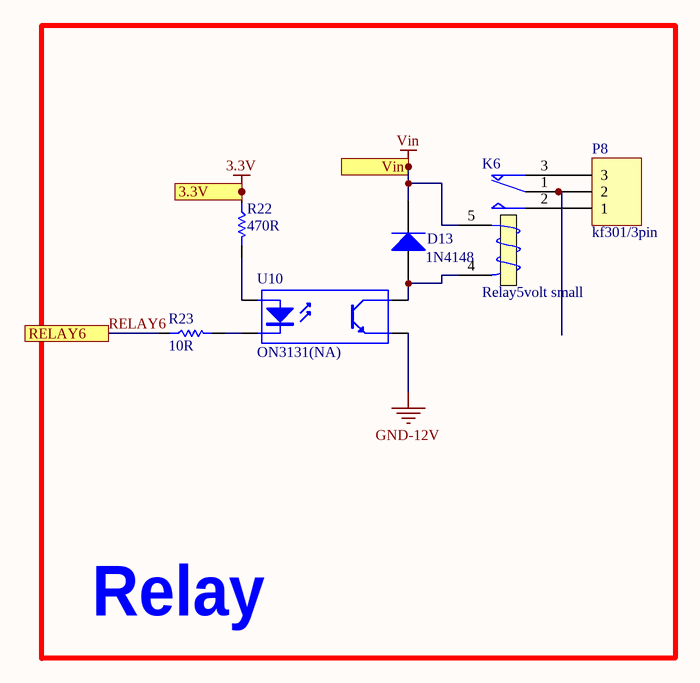
[diagram p10: RELAY6.SchDoc]

### Parts
D13  1N4148  [sod123]
K6  Relay5volt small  [relay5_childern]
P8  kf301/3pin  [Blue Connector 1*3 -kf301]
R22  470R  [0805/resistor]
R23  10R  [0805/resistor]
U10  ON3131(NA)  [OPTO_COUPLER]

### Blocks framed on the sheet
Relay: D13 K6 P8 R22 R23 U10

### Ports
3.3V, RELAY6, Vin

### Nets
3.3V: R22.1 ; port 3.3V
GND-12V: U10.3(E)
Vin: D13.K K6.5 ; port Vin
RELAY6: R23.1 ; port RELAY6
NetD13_A: D13.A K6.4(T2) U10.4(C)
NetK6_1: K6.1(COM) P8.2
NetK6_2: K6.2(NO) P8.1
NetK6_3: K6.3(T1) P8.3
NetR22_2: R22.2 U10.1(A)
NetR23_2: R23.2 U10.2(K)

### Library data of the parts
D13 = Diode 1N4007: 1 Amp General Purpose Rectifier; Published: 8-Jun-2000; LatestRevisionDate: 17-Jul-2002; LatestRevisionNote: Re-released for DXP Platform.; DatasheetVersion: 1998; PackageVersion: Aug-1999; PackageReference: DO-41; Publisher: Altium Limited; PackageDescription: Diode, Axial; Body 5.2 x 2.7 mm (LxDia. max), Lead Dia. 0.86 mm (max); Code_JEDEC: DO-204-AL; ComponentLink1Description: Manufacturer Link; ComponentLink1URL: http://www.fairchildsemi.com/; ComponentLink2Description: Datasheet; ComponentLink2URL: http://www.fairchildsemi.com/ds/1N%2F1N4001.pdf
K6 = Relay: SPDT Relay; Published: 8-Jun-2000; LatestRevisionDate: 17-Jul-2002; LatestRevisionNote: Re-released for DXP Platform.; PackageReference: MODULE5B; Publisher: Altium Limited
P8 = Header 3: LatestRevisionDate: 17-Jul-2002; LatestRevisionNote: Re-released for DXP Platform.; Publisher: Altium Limited
R22 R23 = Resistor: Tolerance: 5%; Power: 1/8 W
  R22: Value: 470R
  R23: Value: 10R
U10 = Optoisolator1: 4-Pin Phototransistor Optocoupler; Published: 24-Mar-1999; LatestRevisionDate: 04-Mar-2005; LatestRevisionNote: Sch pins 3 & 4 Swapped.; DatasheetVersion: Nov-2003; PackageReference: DIP-4; Publisher: Altium Limited

## Sheet RELAY7.SchDoc
size A
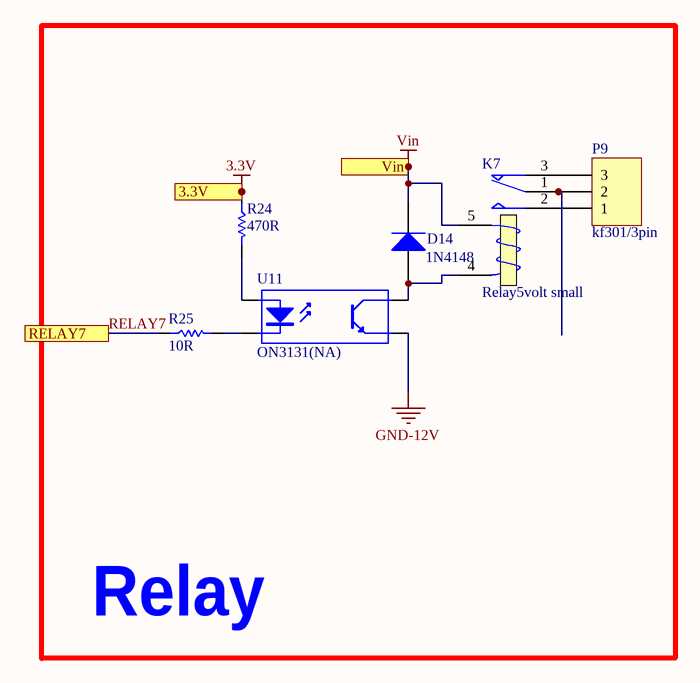
[diagram p11: RELAY7.SchDoc]

### Parts
D14  1N4148  [sod123]
K7  Relay5volt small  [relay5_childern]
P9  kf301/3pin  [Blue Connector 1*3 -kf301]
R24  470R  [0805/resistor]
R25  10R  [0805/resistor]
U11  ON3131(NA)  [OPTO_COUPLER]

### Blocks framed on the sheet
Relay: D14 K7 P9 R24 R25 U11

### Ports
3.3V, RELAY7, Vin

### Nets
3.3V: R24.1 ; port 3.3V
GND-12V: U11.3(E)
Vin: D14.K K7.5 ; port Vin
RELAY7: R25.1 ; port RELAY7
NetD14_A: D14.A K7.4(T2) U11.4(C)
NetK7_1: K7.1(COM) P9.2
NetK7_2: K7.2(NO) P9.1
NetK7_3: K7.3(T1) P9.3
NetR24_2: R24.2 U11.1(A)
NetR25_2: R25.2 U11.2(K)

### Library data of the parts
D14 = Diode 1N4007: 1 Amp General Purpose Rectifier; Published: 8-Jun-2000; LatestRevisionDate: 17-Jul-2002; LatestRevisionNote: Re-released for DXP Platform.; DatasheetVersion: 1998; PackageVersion: Aug-1999; PackageReference: DO-41; Publisher: Altium Limited; PackageDescription: Diode, Axial; Body 5.2 x 2.7 mm (LxDia. max), Lead Dia. 0.86 mm (max); Code_JEDEC: DO-204-AL; ComponentLink1Description: Manufacturer Link; ComponentLink1URL: http://www.fairchildsemi.com/; ComponentLink2Description: Datasheet; ComponentLink2URL: http://www.fairchildsemi.com/ds/1N%2F1N4001.pdf
K7 = Relay: SPDT Relay; Published: 8-Jun-2000; LatestRevisionDate: 17-Jul-2002; LatestRevisionNote: Re-released for DXP Platform.; PackageReference: MODULE5B; Publisher: Altium Limited
P9 = Header 3: LatestRevisionDate: 17-Jul-2002; LatestRevisionNote: Re-released for DXP Platform.; Publisher: Altium Limited
R24 R25 = Resistor: Tolerance: 5%; Power: 1/8 W
  R24: Value: 470R
  R25: Value: 10R
U11 = Optoisolator1: 4-Pin Phototransistor Optocoupler; Published: 24-Mar-1999; LatestRevisionDate: 04-Mar-2005; LatestRevisionNote: Sch pins 3 & 4 Swapped.; DatasheetVersion: Nov-2003; PackageReference: DIP-4; Publisher: Altium Limited

## Sheet RELAY8.SchDoc
size A
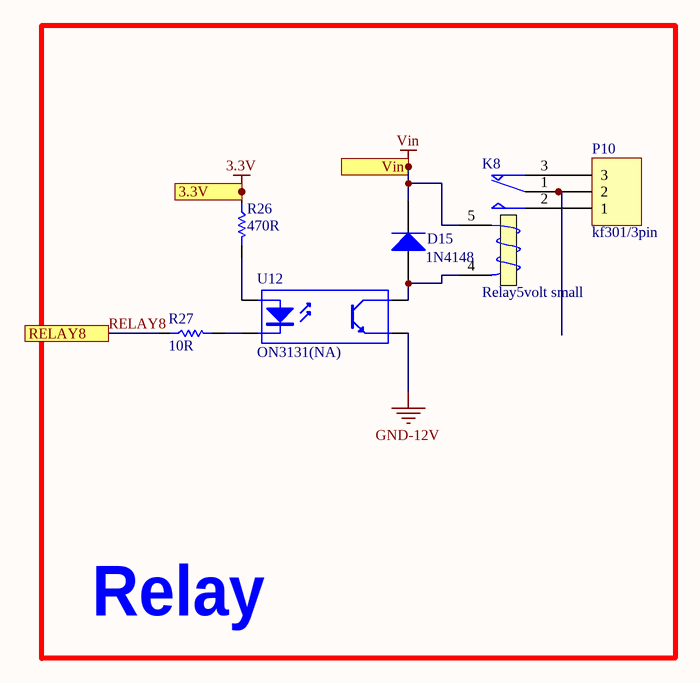
[diagram p12: RELAY8.SchDoc]

### Parts
D15  1N4148  [sod123]
K8  Relay5volt small  [relay5_childern]
P10  kf301/3pin  [Blue Connector 1*3 -kf301]
R26  470R  [0805/resistor]
R27  10R  [0805/resistor]
U12  ON3131(NA)  [OPTO_COUPLER]

### Blocks framed on the sheet
Relay: D15 K8 P10 R26 R27 U12

### Ports
3.3V, RELAY8, Vin

### Nets
3.3V: R26.1 ; port 3.3V
GND-12V: U12.3(E)
Vin: D15.K K8.5 ; port Vin
RELAY8: R27.1 ; port RELAY8
NetD15_A: D15.A K8.4(T2) U12.4(C)
NetK8_1: K8.1(COM) P10.2
NetK8_2: K8.2(NO) P10.1
NetK8_3: K8.3(T1) P10.3
NetR26_2: R26.2 U12.1(A)
NetR27_2: R27.2 U12.2(K)

### Library data of the parts
D15 = Diode 1N4007: 1 Amp General Purpose Rectifier; Published: 8-Jun-2000; LatestRevisionDate: 17-Jul-2002; LatestRevisionNote: Re-released for DXP Platform.; DatasheetVersion: 1998; PackageVersion: Aug-1999; PackageReference: DO-41; Publisher: Altium Limited; PackageDescription: Diode, Axial; Body 5.2 x 2.7 mm (LxDia. max), Lead Dia. 0.86 mm (max); Code_JEDEC: DO-204-AL; ComponentLink1Description: Manufacturer Link; ComponentLink1URL: http://www.fairchildsemi.com/; ComponentLink2Description: Datasheet; ComponentLink2URL: http://www.fairchildsemi.com/ds/1N%2F1N4001.pdf
K8 = Relay: SPDT Relay; Published: 8-Jun-2000; LatestRevisionDate: 17-Jul-2002; LatestRevisionNote: Re-released for DXP Platform.; PackageReference: MODULE5B; Publisher: Altium Limited
P10 = Header 3: LatestRevisionDate: 17-Jul-2002; LatestRevisionNote: Re-released for DXP Platform.; Publisher: Altium Limited
R26 R27 = Resistor: Tolerance: 5%; Power: 1/8 W
  R26: Value: 470R
  R27: Value: 10R
U12 = Optoisolator1: 4-Pin Phototransistor Optocoupler; Published: 24-Mar-1999; LatestRevisionDate: 04-Mar-2005; LatestRevisionNote: Sch pins 3 & 4 Swapped.; DatasheetVersion: Nov-2003; PackageReference: DIP-4; Publisher: Altium Limited

## Sheet RELAY9.SchDoc
size A
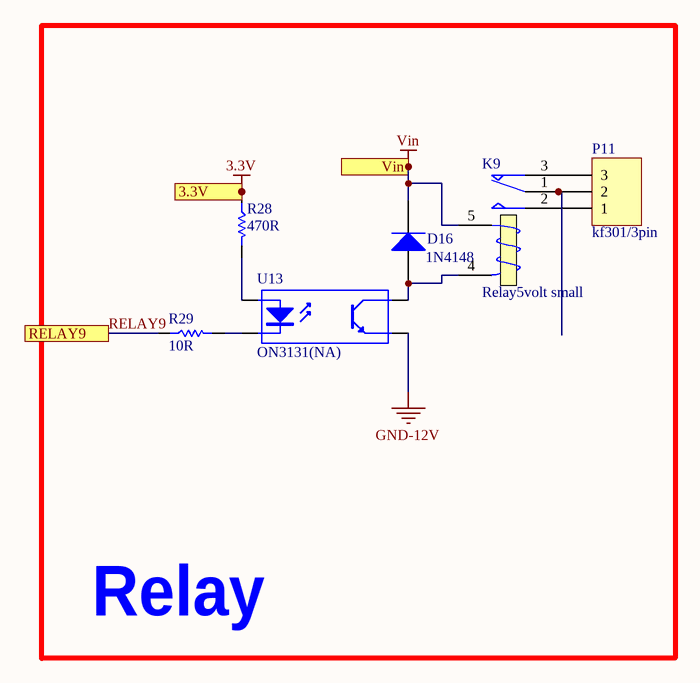
[diagram p13: RELAY9.SchDoc]

### Parts
D16  1N4148  [sod123]
K9  Relay5volt small  [relay5_childern]
P11  kf301/3pin  [Blue Connector 1*3 -kf301]
R28  470R  [0805/resistor]
R29  10R  [0805/resistor]
U13  ON3131(NA)  [OPTO_COUPLER]

### Blocks framed on the sheet
Relay: D16 K9 P11 R28 R29 U13

### Ports
3.3V, RELAY9, Vin

### Nets
3.3V: R28.1 ; port 3.3V
GND-12V: U13.3(E)
Vin: D16.K K9.5 ; port Vin
RELAY9: R29.1 ; port RELAY9
NetD16_A: D16.A K9.4(T2) U13.4(C)
NetK9_1: K9.1(COM) P11.2
NetK9_2: K9.2(NO) P11.1
NetK9_3: K9.3(T1) P11.3
NetR28_2: R28.2 U13.1(A)
NetR29_2: R29.2 U13.2(K)

### Library data of the parts
D16 = Diode 1N4007: 1 Amp General Purpose Rectifier; Published: 8-Jun-2000; LatestRevisionDate: 17-Jul-2002; LatestRevisionNote: Re-released for DXP Platform.; DatasheetVersion: 1998; PackageVersion: Aug-1999; PackageReference: DO-41; Publisher: Altium Limited; PackageDescription: Diode, Axial; Body 5.2 x 2.7 mm (LxDia. max), Lead Dia. 0.86 mm (max); Code_JEDEC: DO-204-AL; ComponentLink1Description: Manufacturer Link; ComponentLink1URL: http://www.fairchildsemi.com/; ComponentLink2Description: Datasheet; ComponentLink2URL: http://www.fairchildsemi.com/ds/1N%2F1N4001.pdf
K9 = Relay: SPDT Relay; Published: 8-Jun-2000; LatestRevisionDate: 17-Jul-2002; LatestRevisionNote: Re-released for DXP Platform.; PackageReference: MODULE5B; Publisher: Altium Limited
P11 = Header 3: LatestRevisionDate: 17-Jul-2002; LatestRevisionNote: Re-released for DXP Platform.; Publisher: Altium Limited
R28 R29 = Resistor: Tolerance: 5%; Power: 1/8 W
  R28: Value: 470R
  R29: Value: 10R
U13 = Optoisolator1: 4-Pin Phototransistor Optocoupler; Published: 24-Mar-1999; LatestRevisionDate: 04-Mar-2005; LatestRevisionNote: Sch pins 3 & 4 Swapped.; DatasheetVersion: Nov-2003; PackageReference: DIP-4; Publisher: Altium Limited

## Sheet RELAY10.SchDoc
size A
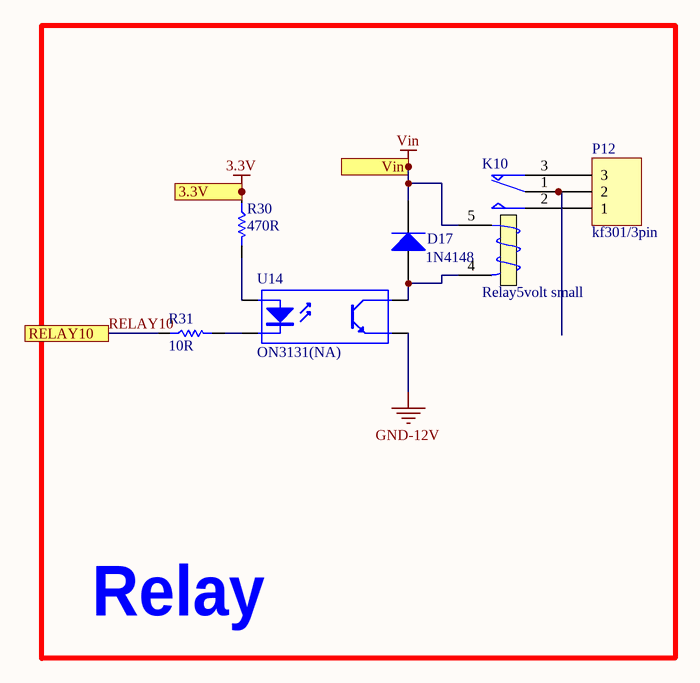
[diagram p14: RELAY10.SchDoc]

### Parts
D17  1N4148  [sod123]
K10  Relay5volt small  [relay5_childern]
P12  kf301/3pin  [Blue Connector 1*3 -kf301]
R30  470R  [0805/resistor]
R31  10R  [0805/resistor]
U14  ON3131(NA)  [OPTO_COUPLER]

### Blocks framed on the sheet
Relay: D17 K10 P12 R30 R31 U14

### Ports
3.3V, RELAY10, Vin

### Nets
3.3V: R30.1 ; port 3.3V
GND-12V: U14.3(E)
Vin: D17.K K10.5 ; port Vin
RELAY10: R31.1 ; port RELAY10
NetD17_A: D17.A K10.4(T2) U14.4(C)
NetK10_1: K10.1(COM) P12.2
NetK10_2: K10.2(NO) P12.1
NetK10_3: K10.3(T1) P12.3
NetR30_2: R30.2 U14.1(A)
NetR31_2: R31.2 U14.2(K)

### Library data of the parts
D17 = Diode 1N4007: 1 Amp General Purpose Rectifier; Published: 8-Jun-2000; LatestRevisionDate: 17-Jul-2002; LatestRevisionNote: Re-released for DXP Platform.; DatasheetVersion: 1998; PackageVersion: Aug-1999; PackageReference: DO-41; Publisher: Altium Limited; PackageDescription: Diode, Axial; Body 5.2 x 2.7 mm (LxDia. max), Lead Dia. 0.86 mm (max); Code_JEDEC: DO-204-AL; ComponentLink1Description: Manufacturer Link; ComponentLink1URL: http://www.fairchildsemi.com/; ComponentLink2Description: Datasheet; ComponentLink2URL: http://www.fairchildsemi.com/ds/1N%2F1N4001.pdf
K10 = Relay: SPDT Relay; Published: 8-Jun-2000; LatestRevisionDate: 17-Jul-2002; LatestRevisionNote: Re-released for DXP Platform.; PackageReference: MODULE5B; Publisher: Altium Limited
P12 = Header 3: LatestRevisionDate: 17-Jul-2002; LatestRevisionNote: Re-released for DXP Platform.; Publisher: Altium Limited
R30 R31 = Resistor: Tolerance: 5%; Power: 1/8 W
  R30: Value: 470R
  R31: Value: 10R
U14 = Optoisolator1: 4-Pin Phototransistor Optocoupler; Published: 24-Mar-1999; LatestRevisionDate: 04-Mar-2005; LatestRevisionNote: Sch pins 3 & 4 Swapped.; DatasheetVersion: Nov-2003; PackageReference: DIP-4; Publisher: Altium Limited

## Sheet RELAY11.SchDoc
size A
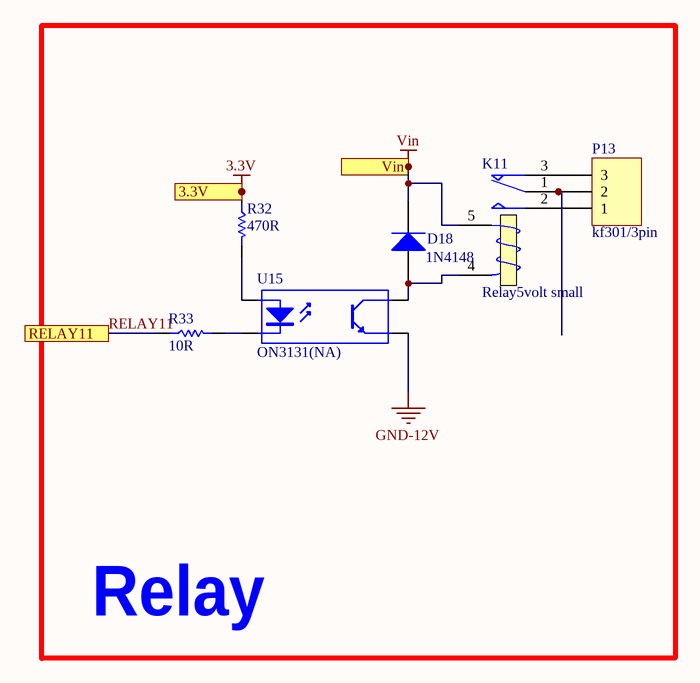
[diagram p15: RELAY11.SchDoc]

### Parts
D18  1N4148  [sod123]
K11  Relay5volt small  [relay5_childern]
P13  kf301/3pin  [Blue Connector 1*3 -kf301]
R32  470R  [0805/resistor]
R33  10R  [0805/resistor]
U15  ON3131(NA)  [OPTO_COUPLER]

### Blocks framed on the sheet
Relay: D18 K11 P13 R32 R33 U15

### Ports
3.3V, RELAY11, Vin

### Nets
3.3V: R32.1 ; port 3.3V
GND-12V: U15.3(E)
Vin: D18.K K11.5 ; port Vin
RELAY11: R33.1 ; port RELAY11
NetD18_A: D18.A K11.4(T2) U15.4(C)
NetK11_1: K11.1(COM) P13.2
NetK11_2: K11.2(NO) P13.1
NetK11_3: K11.3(T1) P13.3
NetR32_2: R32.2 U15.1(A)
NetR33_2: R33.2 U15.2(K)

### Library data of the parts
D18 = Diode 1N4007: 1 Amp General Purpose Rectifier; Published: 8-Jun-2000; LatestRevisionDate: 17-Jul-2002; LatestRevisionNote: Re-released for DXP Platform.; DatasheetVersion: 1998; PackageVersion: Aug-1999; PackageReference: DO-41; Publisher: Altium Limited; PackageDescription: Diode, Axial; Body 5.2 x 2.7 mm (LxDia. max), Lead Dia. 0.86 mm (max); Code_JEDEC: DO-204-AL; ComponentLink1Description: Manufacturer Link; ComponentLink1URL: http://www.fairchildsemi.com/; ComponentLink2Description: Datasheet; ComponentLink2URL: http://www.fairchildsemi.com/ds/1N%2F1N4001.pdf
K11 = Relay: SPDT Relay; Published: 8-Jun-2000; LatestRevisionDate: 17-Jul-2002; LatestRevisionNote: Re-released for DXP Platform.; PackageReference: MODULE5B; Publisher: Altium Limited
P13 = Header 3: LatestRevisionDate: 17-Jul-2002; LatestRevisionNote: Re-released for DXP Platform.; Publisher: Altium Limited
R32 R33 = Resistor: Tolerance: 5%; Power: 1/8 W
  R32: Value: 470R
  R33: Value: 10R
U15 = Optoisolator1: 4-Pin Phototransistor Optocoupler; Published: 24-Mar-1999; LatestRevisionDate: 04-Mar-2005; LatestRevisionNote: Sch pins 3 & 4 Swapped.; DatasheetVersion: Nov-2003; PackageReference: DIP-4; Publisher: Altium Limited

## Sheet RELAY12.SchDoc
size A
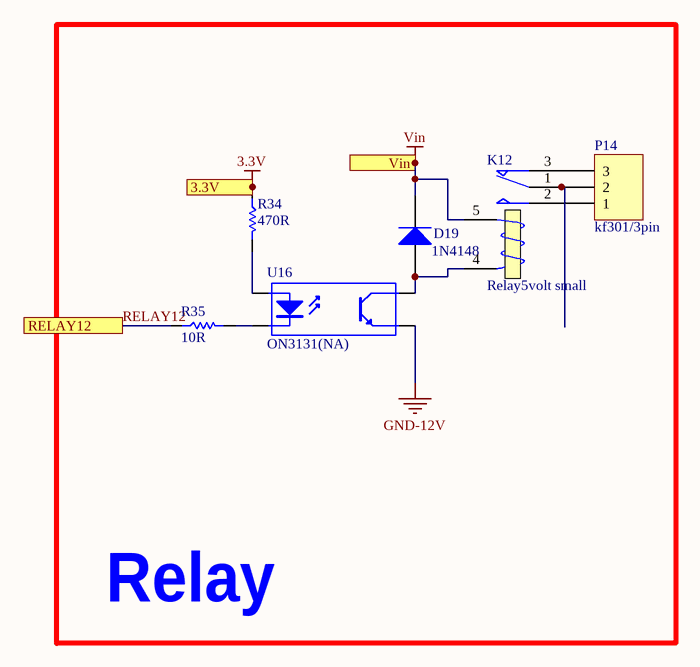
[diagram p16: RELAY12.SchDoc]

### Parts
D19  1N4148  [sod123]
K12  Relay5volt small  [relay5_childern]
P14  kf301/3pin  [Blue Connector 1*3 -kf301]
R34  470R  [0805/resistor]
R35  10R  [0805/resistor]
U16  ON3131(NA)  [OPTO_COUPLER]

### Blocks framed on the sheet
Relay: D19 K12 P14 R34 R35 U16

### Ports
3.3V, RELAY12, Vin

### Nets
3.3V: R34.1 ; port 3.3V
GND-12V: U16.3(E)
Vin: D19.K K12.5 ; port Vin
RELAY12: R35.1 ; port RELAY12
NetD19_A: D19.A K12.4(T2) U16.4(C)
NetK12_1: K12.1(COM) P14.2
NetK12_2: K12.2(NO) P14.1
NetK12_3: K12.3(T1) P14.3
NetR34_2: R34.2 U16.1(A)
NetR35_2: R35.2 U16.2(K)

### Library data of the parts
D19 = Diode 1N4007: 1 Amp General Purpose Rectifier; Published: 8-Jun-2000; LatestRevisionDate: 17-Jul-2002; LatestRevisionNote: Re-released for DXP Platform.; DatasheetVersion: 1998; PackageVersion: Aug-1999; PackageReference: DO-41; Publisher: Altium Limited; PackageDescription: Diode, Axial; Body 5.2 x 2.7 mm (LxDia. max), Lead Dia. 0.86 mm (max); Code_JEDEC: DO-204-AL; ComponentLink1Description: Manufacturer Link; ComponentLink1URL: http://www.fairchildsemi.com/; ComponentLink2Description: Datasheet; ComponentLink2URL: http://www.fairchildsemi.com/ds/1N%2F1N4001.pdf
K12 = Relay: SPDT Relay; Published: 8-Jun-2000; LatestRevisionDate: 17-Jul-2002; LatestRevisionNote: Re-released for DXP Platform.; PackageReference: MODULE5B; Publisher: Altium Limited
P14 = Header 3: LatestRevisionDate: 17-Jul-2002; LatestRevisionNote: Re-released for DXP Platform.; Publisher: Altium Limited
R34 R35 = Resistor: Tolerance: 5%; Power: 1/8 W
  R34: Value: 470R
  R35: Value: 10R
U16 = Optoisolator1: 4-Pin Phototransistor Optocoupler; Published: 24-Mar-1999; LatestRevisionDate: 04-Mar-2005; LatestRevisionNote: Sch pins 3 & 4 Swapped.; DatasheetVersion: Nov-2003; PackageReference: DIP-4; Publisher: Altium Limited

## Sheet RELAY13.SchDoc
size A
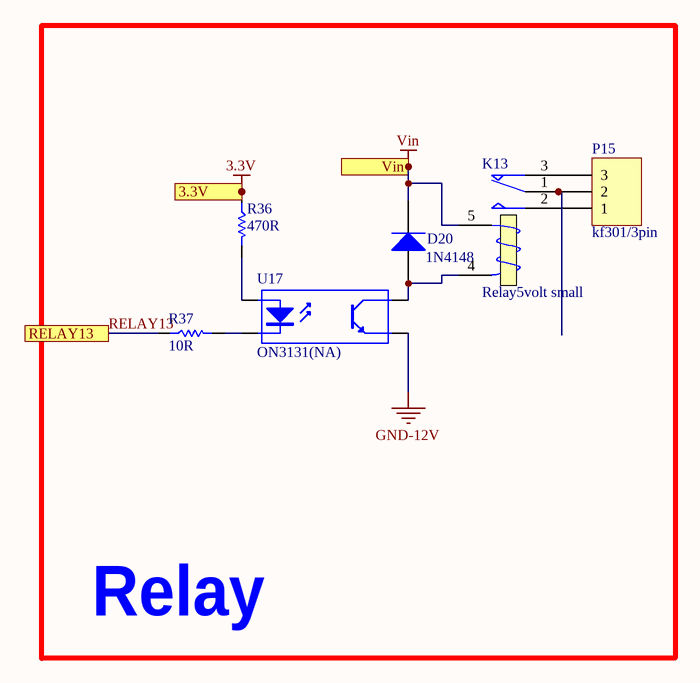
[diagram p17: RELAY13.SchDoc]

### Parts
D20  1N4148  [sod123]
K13  Relay5volt small  [relay5_childern]
P15  kf301/3pin  [Blue Connector 1*3 -kf301]
R36  470R  [0805/resistor]
R37  10R  [0805/resistor]
U17  ON3131(NA)  [OPTO_COUPLER]

### Blocks framed on the sheet
Relay: D20 K13 P15 R36 R37 U17

### Ports
3.3V, RELAY13, Vin

### Nets
3.3V: R36.1 ; port 3.3V
GND-12V: U17.3(E)
Vin: D20.K K13.5 ; port Vin
RELAY13: R37.1 ; port RELAY13
NetD20_A: D20.A K13.4(T2) U17.4(C)
NetK13_1: K13.1(COM) P15.2
NetK13_2: K13.2(NO) P15.1
NetK13_3: K13.3(T1) P15.3
NetR36_2: R36.2 U17.1(A)
NetR37_2: R37.2 U17.2(K)

### Library data of the parts
D20 = Diode 1N4007: 1 Amp General Purpose Rectifier; Published: 8-Jun-2000; LatestRevisionDate: 17-Jul-2002; LatestRevisionNote: Re-released for DXP Platform.; DatasheetVersion: 1998; PackageVersion: Aug-1999; PackageReference: DO-41; Publisher: Altium Limited; PackageDescription: Diode, Axial; Body 5.2 x 2.7 mm (LxDia. max), Lead Dia. 0.86 mm (max); Code_JEDEC: DO-204-AL; ComponentLink1Description: Manufacturer Link; ComponentLink1URL: http://www.fairchildsemi.com/; ComponentLink2Description: Datasheet; ComponentLink2URL: http://www.fairchildsemi.com/ds/1N%2F1N4001.pdf
K13 = Relay: SPDT Relay; Published: 8-Jun-2000; LatestRevisionDate: 17-Jul-2002; LatestRevisionNote: Re-released for DXP Platform.; PackageReference: MODULE5B; Publisher: Altium Limited
P15 = Header 3: LatestRevisionDate: 17-Jul-2002; LatestRevisionNote: Re-released for DXP Platform.; Publisher: Altium Limited
R36 R37 = Resistor: Tolerance: 5%; Power: 1/8 W
  R36: Value: 470R
  R37: Value: 10R
U17 = Optoisolator1: 4-Pin Phototransistor Optocoupler; Published: 24-Mar-1999; LatestRevisionDate: 04-Mar-2005; LatestRevisionNote: Sch pins 3 & 4 Swapped.; DatasheetVersion: Nov-2003; PackageReference: DIP-4; Publisher: Altium Limited

## Sheet RELAY14.SchDoc
size A
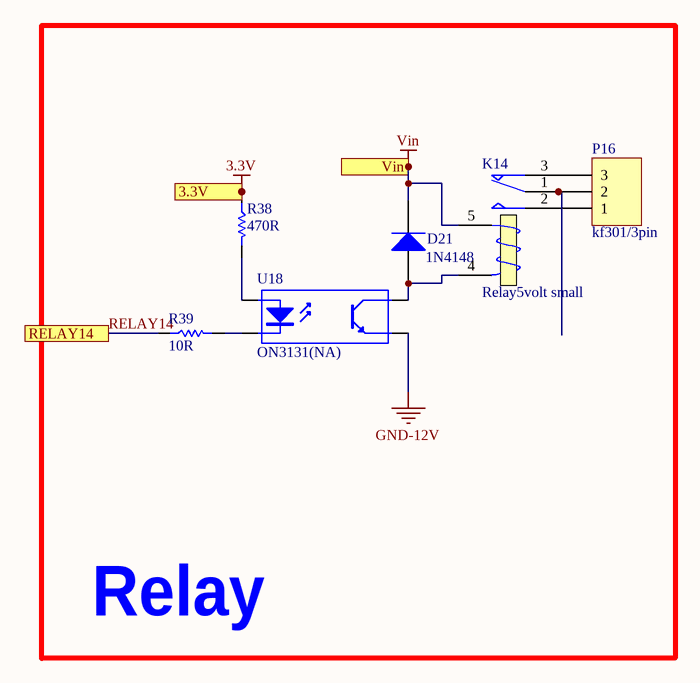
[diagram p18: RELAY14.SchDoc]

### Parts
D21  1N4148  [sod123]
K14  Relay5volt small  [relay5_childern]
P16  kf301/3pin  [Blue Connector 1*3 -kf301]
R38  470R  [0805/resistor]
R39  10R  [0805/resistor]
U18  ON3131(NA)  [OPTO_COUPLER]

### Blocks framed on the sheet
Relay: D21 K14 P16 R38 R39 U18

### Ports
3.3V, RELAY14, Vin

### Nets
3.3V: R38.1 ; port 3.3V
GND-12V: U18.3(E)
Vin: D21.K K14.5 ; port Vin
RELAY14: R39.1 ; port RELAY14
NetD21_A: D21.A K14.4(T2) U18.4(C)
NetK14_1: K14.1(COM) P16.2
NetK14_2: K14.2(NO) P16.1
NetK14_3: K14.3(T1) P16.3
NetR38_2: R38.2 U18.1(A)
NetR39_2: R39.2 U18.2(K)

### Library data of the parts
D21 = Diode 1N4007: 1 Amp General Purpose Rectifier; Published: 8-Jun-2000; LatestRevisionDate: 17-Jul-2002; LatestRevisionNote: Re-released for DXP Platform.; DatasheetVersion: 1998; PackageVersion: Aug-1999; PackageReference: DO-41; Publisher: Altium Limited; PackageDescription: Diode, Axial; Body 5.2 x 2.7 mm (LxDia. max), Lead Dia. 0.86 mm (max); Code_JEDEC: DO-204-AL; ComponentLink1Description: Manufacturer Link; ComponentLink1URL: http://www.fairchildsemi.com/; ComponentLink2Description: Datasheet; ComponentLink2URL: http://www.fairchildsemi.com/ds/1N%2F1N4001.pdf
K14 = Relay: SPDT Relay; Published: 8-Jun-2000; LatestRevisionDate: 17-Jul-2002; LatestRevisionNote: Re-released for DXP Platform.; PackageReference: MODULE5B; Publisher: Altium Limited
P16 = Header 3: LatestRevisionDate: 17-Jul-2002; LatestRevisionNote: Re-released for DXP Platform.; Publisher: Altium Limited
R38 R39 = Resistor: Tolerance: 5%; Power: 1/8 W
  R38: Value: 470R
  R39: Value: 10R
U18 = Optoisolator1: 4-Pin Phototransistor Optocoupler; Published: 24-Mar-1999; LatestRevisionDate: 04-Mar-2005; LatestRevisionNote: Sch pins 3 & 4 Swapped.; DatasheetVersion: Nov-2003; PackageReference: DIP-4; Publisher: Altium Limited

## Sheet RELAY15.SchDoc
size A
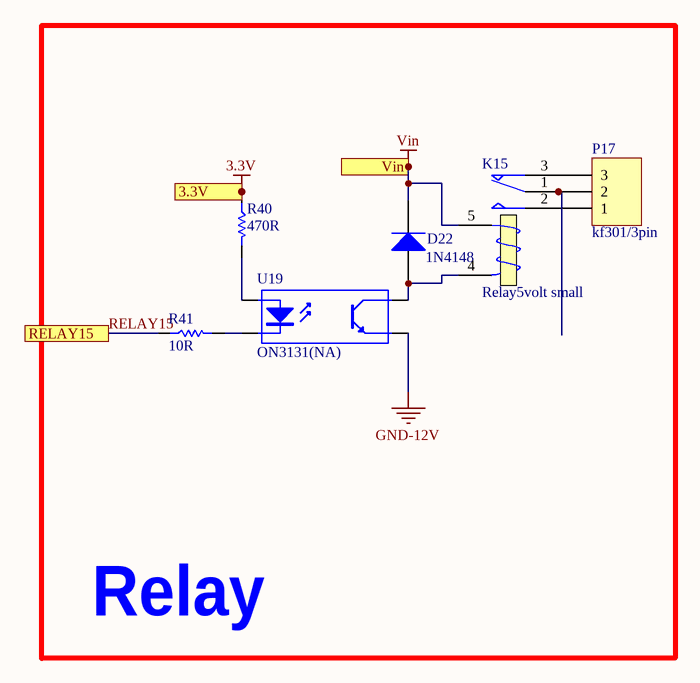
[diagram p19: RELAY15.SchDoc]

### Parts
D22  1N4148  [sod123]
K15  Relay5volt small  [relay5_childern]
P17  kf301/3pin  [Blue Connector 1*3 -kf301]
R40  470R  [0805/resistor]
R41  10R  [0805/resistor]
U19  ON3131(NA)  [OPTO_COUPLER]

### Blocks framed on the sheet
Relay: D22 K15 P17 R40 R41 U19

### Ports
3.3V, RELAY15, Vin

### Nets
3.3V: R40.1 ; port 3.3V
GND-12V: U19.3(E)
Vin: D22.K K15.5 ; port Vin
RELAY15: R41.1 ; port RELAY15
NetD22_A: D22.A K15.4(T2) U19.4(C)
NetK15_1: K15.1(COM) P17.2
NetK15_2: K15.2(NO) P17.1
NetK15_3: K15.3(T1) P17.3
NetR40_2: R40.2 U19.1(A)
NetR41_2: R41.2 U19.2(K)

### Library data of the parts
D22 = Diode 1N4007: 1 Amp General Purpose Rectifier; Published: 8-Jun-2000; LatestRevisionDate: 17-Jul-2002; LatestRevisionNote: Re-released for DXP Platform.; DatasheetVersion: 1998; PackageVersion: Aug-1999; PackageReference: DO-41; Publisher: Altium Limited; PackageDescription: Diode, Axial; Body 5.2 x 2.7 mm (LxDia. max), Lead Dia. 0.86 mm (max); Code_JEDEC: DO-204-AL; ComponentLink1Description: Manufacturer Link; ComponentLink1URL: http://www.fairchildsemi.com/; ComponentLink2Description: Datasheet; ComponentLink2URL: http://www.fairchildsemi.com/ds/1N%2F1N4001.pdf
K15 = Relay: SPDT Relay; Published: 8-Jun-2000; LatestRevisionDate: 17-Jul-2002; LatestRevisionNote: Re-released for DXP Platform.; PackageReference: MODULE5B; Publisher: Altium Limited
P17 = Header 3: LatestRevisionDate: 17-Jul-2002; LatestRevisionNote: Re-released for DXP Platform.; Publisher: Altium Limited
R40 R41 = Resistor: Tolerance: 5%; Power: 1/8 W
  R40: Value: 470R
  R41: Value: 10R
U19 = Optoisolator1: 4-Pin Phototransistor Optocoupler; Published: 24-Mar-1999; LatestRevisionDate: 04-Mar-2005; LatestRevisionNote: Sch pins 3 & 4 Swapped.; DatasheetVersion: Nov-2003; PackageReference: DIP-4; Publisher: Altium Limited

## Sheet RELAY16.SchDoc
size A
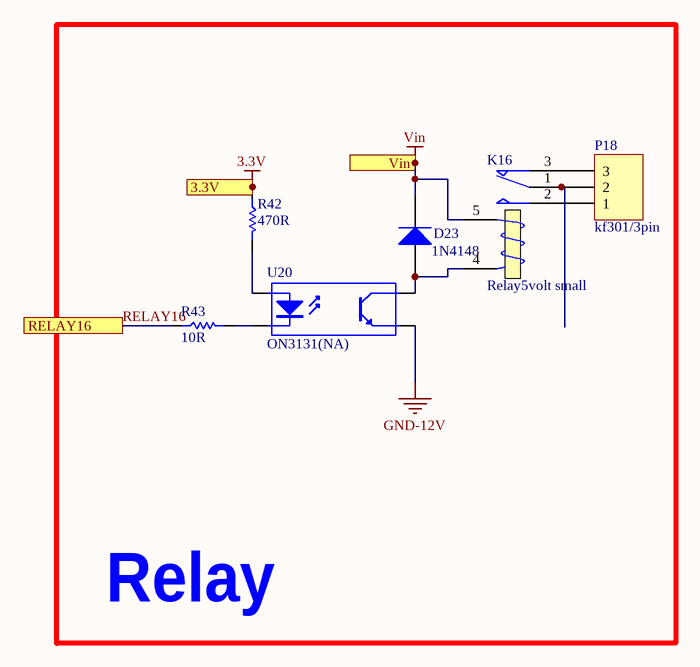
[diagram p20: RELAY16.SchDoc]

### Parts
D23  1N4148  [sod123]
K16  Relay5volt small  [relay5_childern]
P18  kf301/3pin  [Blue Connector 1*3 -kf301]
R42  470R  [0805/resistor]
R43  10R  [0805/resistor]
U20  ON3131(NA)  [OPTO_COUPLER]

### Blocks framed on the sheet
Relay: D23 K16 P18 R42 R43 U20

### Ports
3.3V, RELAY16, Vin

### Nets
3.3V: R42.1 ; port 3.3V
GND-12V: U20.3(E)
Vin: D23.K K16.5 ; port Vin
RELAY16: R43.1 ; port RELAY16
NetD23_A: D23.A K16.4(T2) U20.4(C)
NetK16_1: K16.1(COM) P18.2
NetK16_2: K16.2(NO) P18.1
NetK16_3: K16.3(T1) P18.3
NetR42_2: R42.2 U20.1(A)
NetR43_2: R43.2 U20.2(K)

### Library data of the parts
D23 = Diode 1N4007: 1 Amp General Purpose Rectifier; Published: 8-Jun-2000; LatestRevisionDate: 17-Jul-2002; LatestRevisionNote: Re-released for DXP Platform.; DatasheetVersion: 1998; PackageVersion: Aug-1999; PackageReference: DO-41; Publisher: Altium Limited; PackageDescription: Diode, Axial; Body 5.2 x 2.7 mm (LxDia. max), Lead Dia. 0.86 mm (max); Code_JEDEC: DO-204-AL; ComponentLink1Description: Manufacturer Link; ComponentLink1URL: http://www.fairchildsemi.com/; ComponentLink2Description: Datasheet; ComponentLink2URL: http://www.fairchildsemi.com/ds/1N%2F1N4001.pdf
K16 = Relay: SPDT Relay; Published: 8-Jun-2000; LatestRevisionDate: 17-Jul-2002; LatestRevisionNote: Re-released for DXP Platform.; PackageReference: MODULE5B; Publisher: Altium Limited
P18 = Header 3: LatestRevisionDate: 17-Jul-2002; LatestRevisionNote: Re-released for DXP Platform.; Publisher: Altium Limited
R42 R43 = Resistor: Tolerance: 5%; Power: 1/8 W
  R42: Value: 470R
  R43: Value: 10R
U20 = Optoisolator1: 4-Pin Phototransistor Optocoupler; Published: 24-Mar-1999; LatestRevisionDate: 04-Mar-2005; LatestRevisionNote: Sch pins 3 & 4 Swapped.; DatasheetVersion: Nov-2003; PackageReference: DIP-4; Publisher: Altium Limited